# EAGLE design coronaampel_v2_fixed (EAGLE 6.4)

## Sheet 1 of 6
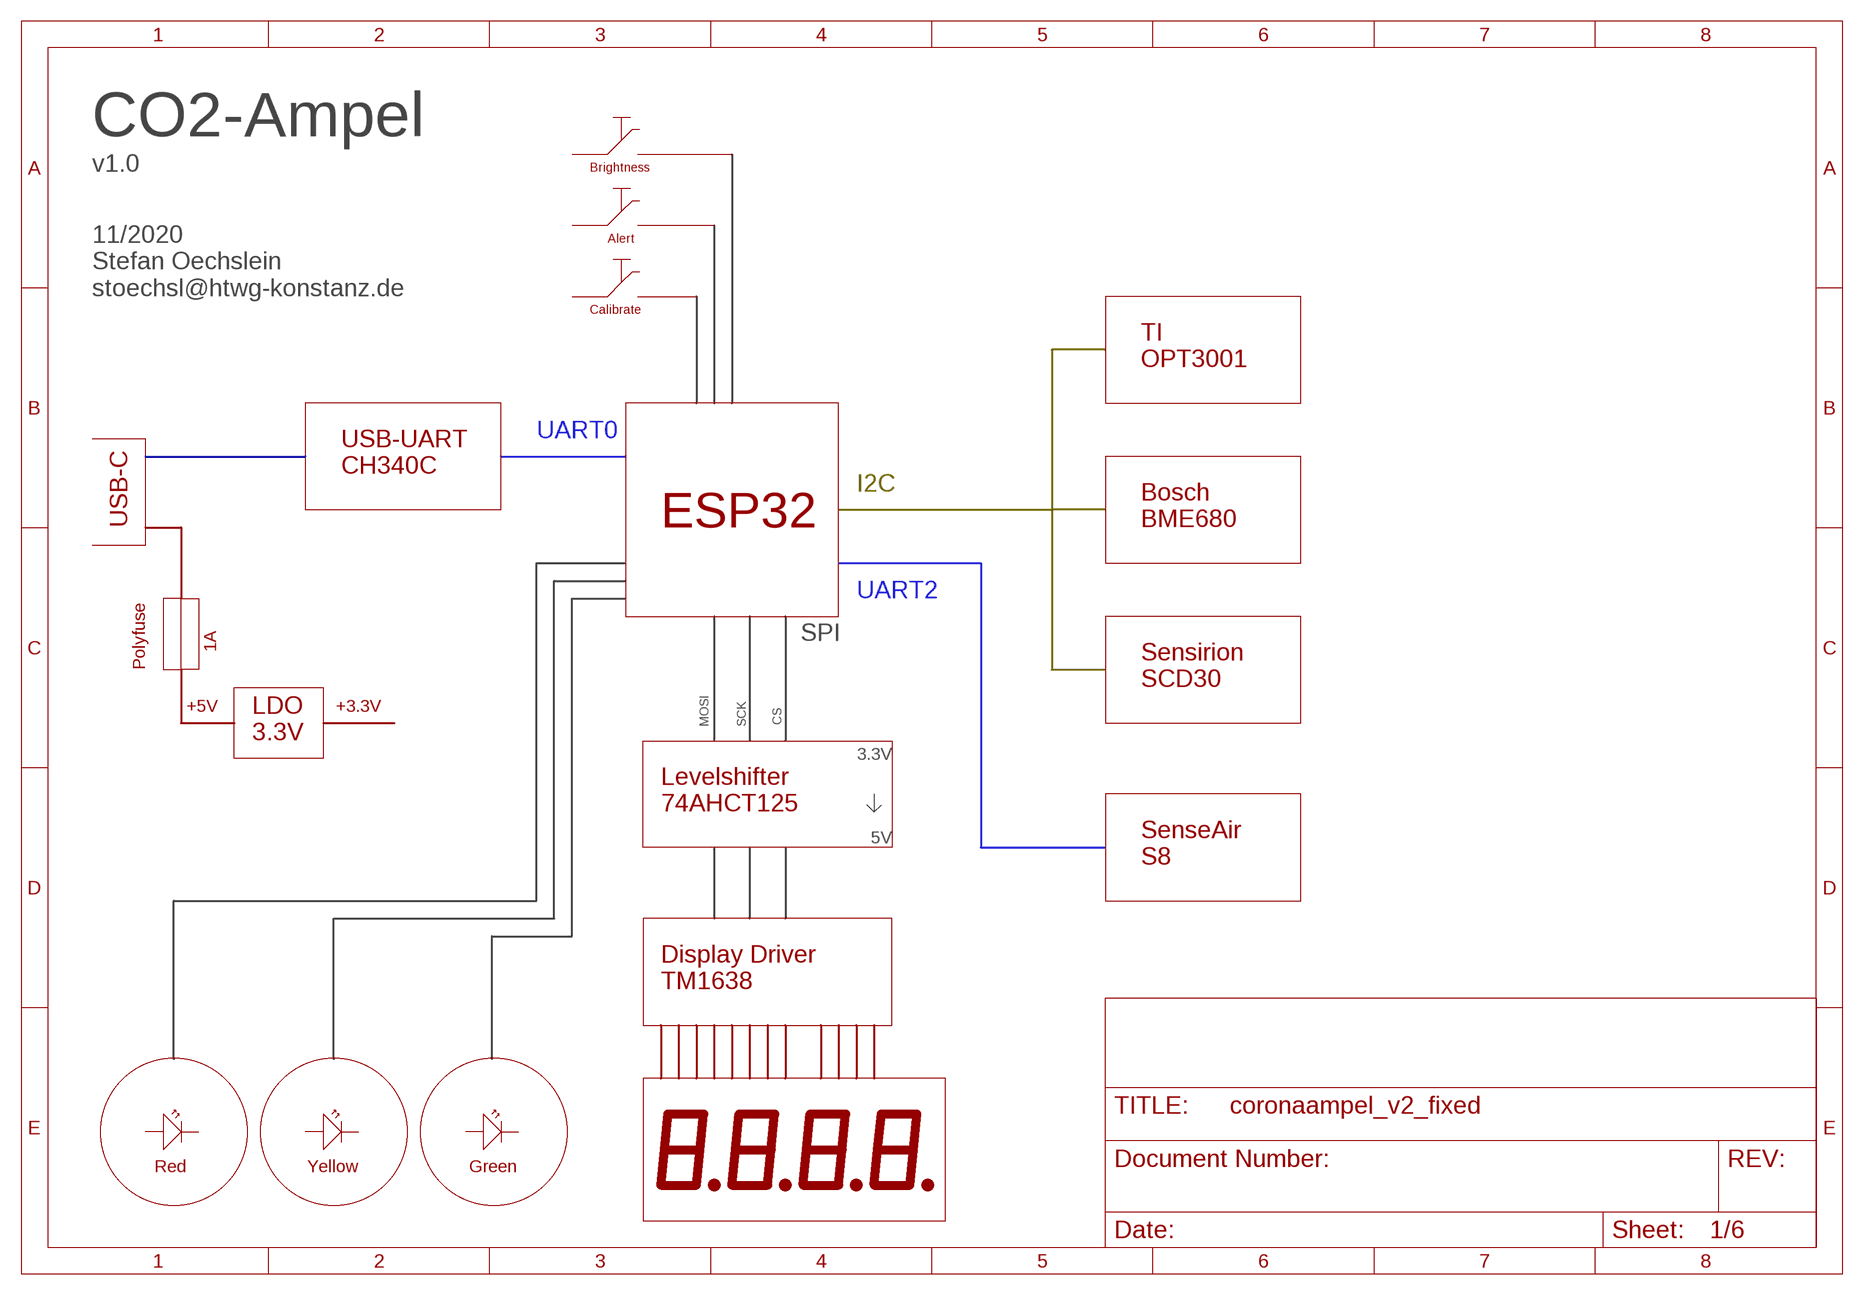
[diagram p0: schematic, sheet 1]

### Buses
B$1

### Notes on the sheet
- CO2-Ampel
- v1.0 | Brightness
- Alert
- 11/2020
  Stefan Oechslein
  stoechsl@htwg-konstanz.de
- Calibrate
- TI
  OPT3001
- UART0
- USB-UART
  CH340C
- I2C
- USB-C | ESP32
- Bosch
  BME680
- UART2
- SPI
- 1A
- Polyfuse
- Sensirion
  SCD30
- +5V | +3.3V
- MOSI | SCK | CS
- LDO
  3.3V
- 3.3V
- Levelshifter
  74AHCT125
- 5V
- SenseAir
  S8
- Display Driver
  TM1638
- Red | Yellow | Green

## Sheet 2 of 6: Supply & Programming
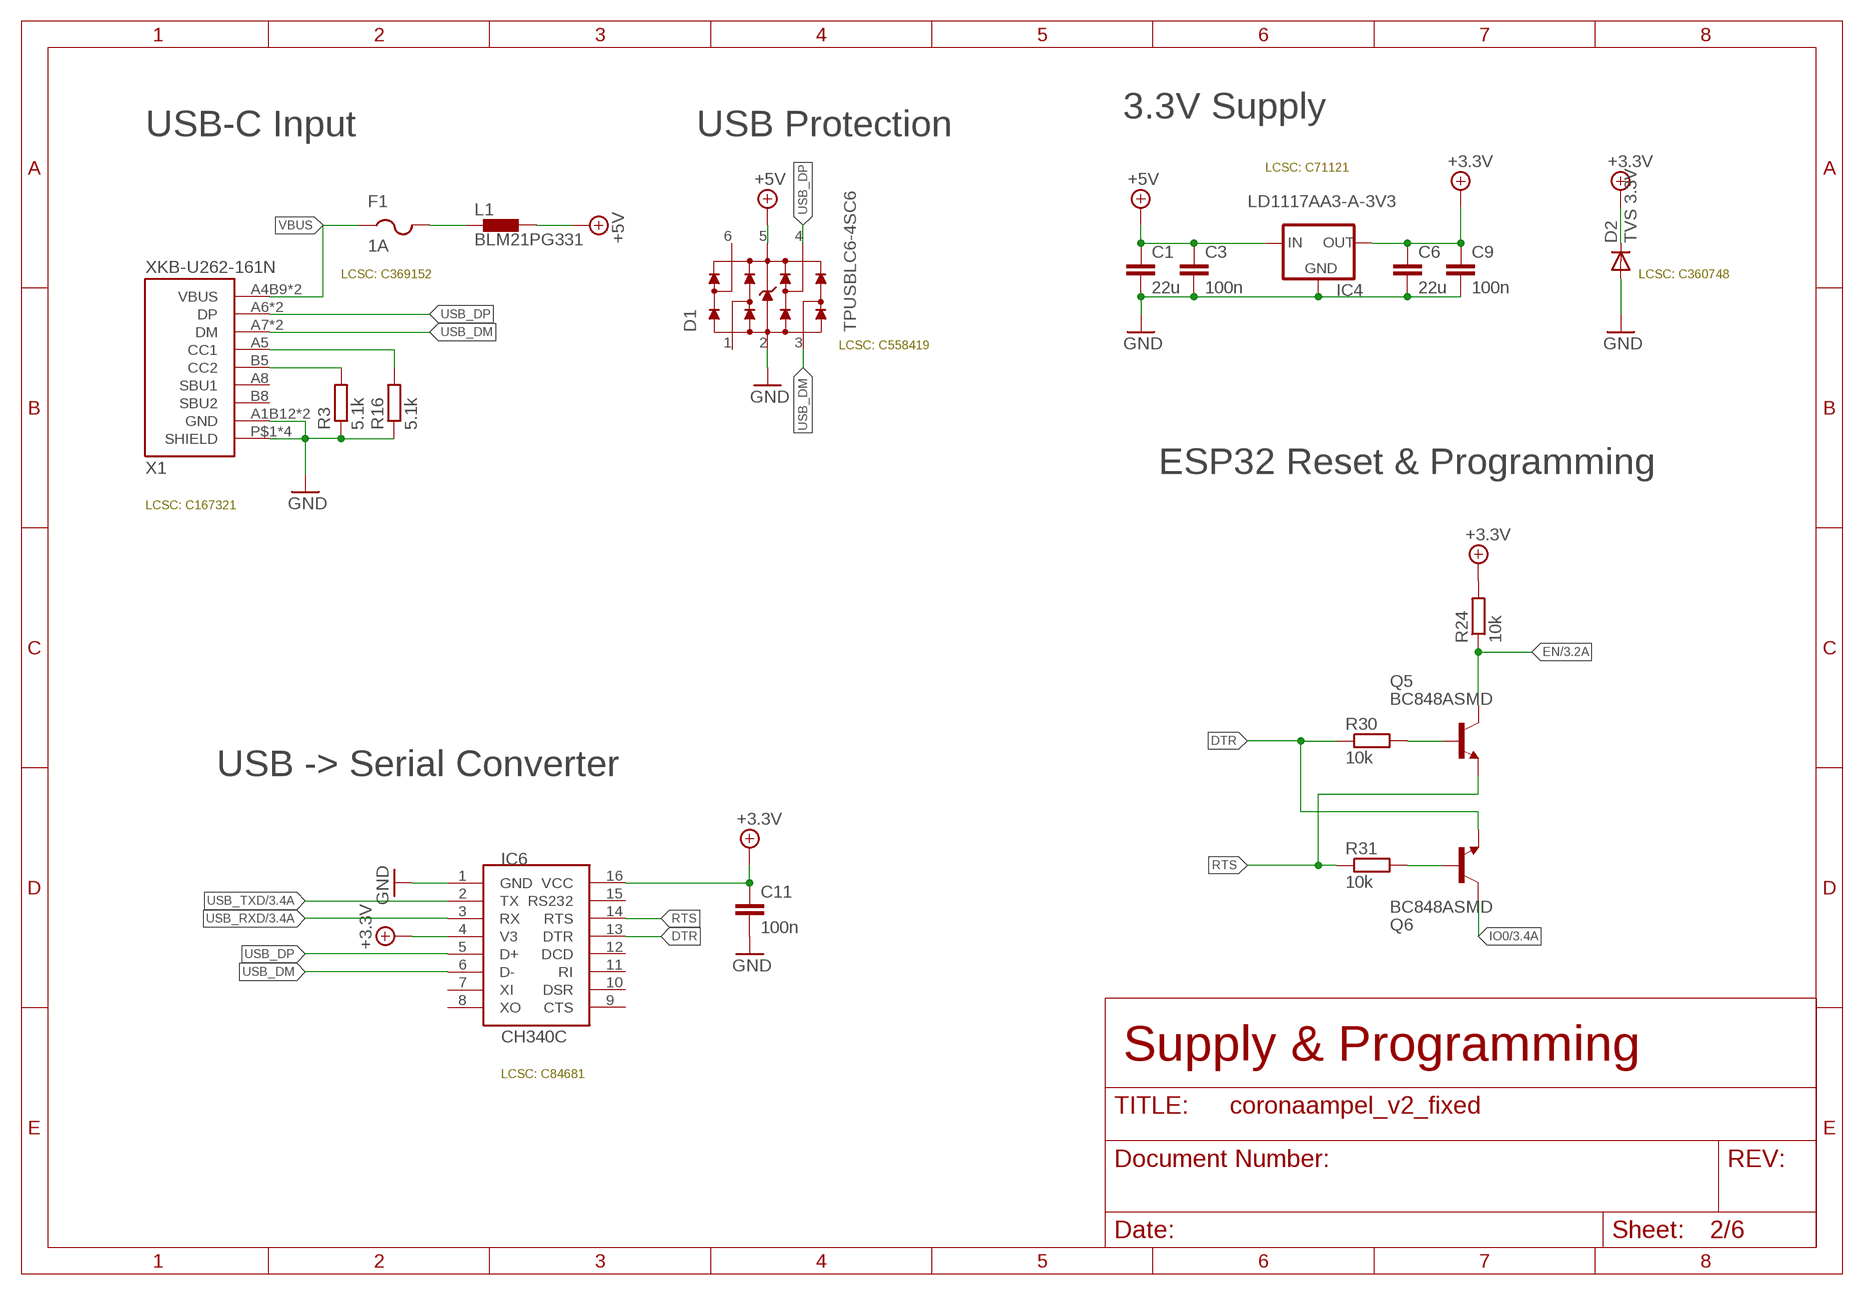
[diagram p1: schematic, sheet 2]

### Parts
C1  22u  C-EUC0805  [C0805]
C3  100n  C-EUC0805  [C0805]
C6  22u  C-EUC0805  [C0805]
C9  100n  C-EUC0805  [C0805]
C11  100n  C-EUC0805  [C0805]
D1  TPUSBLC6-4SC6  WE-TVS_824001  [WE-TVS_SOT23-6L]
D2  TVS 3.3V  DIODE-SOD123  [SOD123]
F1  1A  PTCFUSE-0805  [R0805]
IC4  LD1117AA3-A-3V3  LD1117AA3-A  [SOT223]
IC6  CH340C  CH340G  [SOIC16]
L1  BLM21PG331  [0805]
Q5  BC848ASMD  [SOT23]
Q6  BC848ASMD  [SOT23]
R3  5.1k  R-EU_R0805  [R0805]
R16  5.1k  R-EU_R0805  [R0805]
R24  10k  R-EU_R0805  [R0805]
R30  10k  R-EU_R0805  [R0805]
R31  10k  R-EU_R0805  [R0805]
X1  XKB-U262-161N  [XKB_U262-161N]

### Nets
+3,3V: C6.1 C9.1 C11.1 D2.C IC4.2(OUT) IC4.4(OUT) IC6.4(V3) IC6.16(VCC) R24.2 ; supply symbol labelled +3.3V ; also sheet 3,4,6
+5V: C1.1 C3.1 D1.5(VDD) IC4.3(IN) L1.2 ; also sheet 3,4,5,6
CC1: R16.2 X1.A5(CC1)
CC2: R3.2 X1.B5(CC2)
DTR: IC6.13(DTR) Q6.2(E) R30.1
EN: Q5.3(C) R24.1 ; also sheet 3
GND: C1.2 C3.2 C6.2 C9.2 C11.2 D1.2(GND) D2.A IC4.1(GND) IC6.1(GND) R3.1 R16.1 X1.A1B12(GND) X1.B1A12(GND) X1.P$1(SHIELD) X1.P$2(SHIELD) X1.P$3(SHIELD) X1.P$4(SHIELD) ; also sheet 3,4,5,6
IO0: Q6.3(C) ; also sheet 3
N$10: Q6.1(B) R31.2
N$13: Q5.1(B) R30.2
RTS: IC6.14(RTS) Q5.2(E) R31.1
USB_DM: D1.3 IC6.6(D-) X1.A7(DM) X1.B7(DM)
USB_DP: D1.4 IC6.5(D+) X1.A6(DP) X1.B6(DP)
USB_RXD: IC6.3(RX) ; also sheet 3
USB_TXD: IC6.2(TX) ; also sheet 3
VBUS: F1.1 X1.A4B9(VBUS) X1.B4A9(VBUS)
VIN: F1.2 L1.1
Unconnected: D1.1 D1.6 IC6.7(XI) IC6.8(XO) IC6.9(CTS) IC6.10(DSR) IC6.11(RI) IC6.12(DCD) IC6.15(RS232) X1.A8(SBU1) X1.B8(SBU2)

### Notes on the sheet
- 3.3V Supply
- USB-C Input | USB Protection
- LCSC: C71121
- LCSC: C369152 | LCSC: C360748
- LCSC: C558419
- ESP32 Reset & Programming
- LCSC: C167321
- USB -> Serial Converter
- Supply & Programming
- LCSC: C84681

## Sheet 3 of 6: ESP32
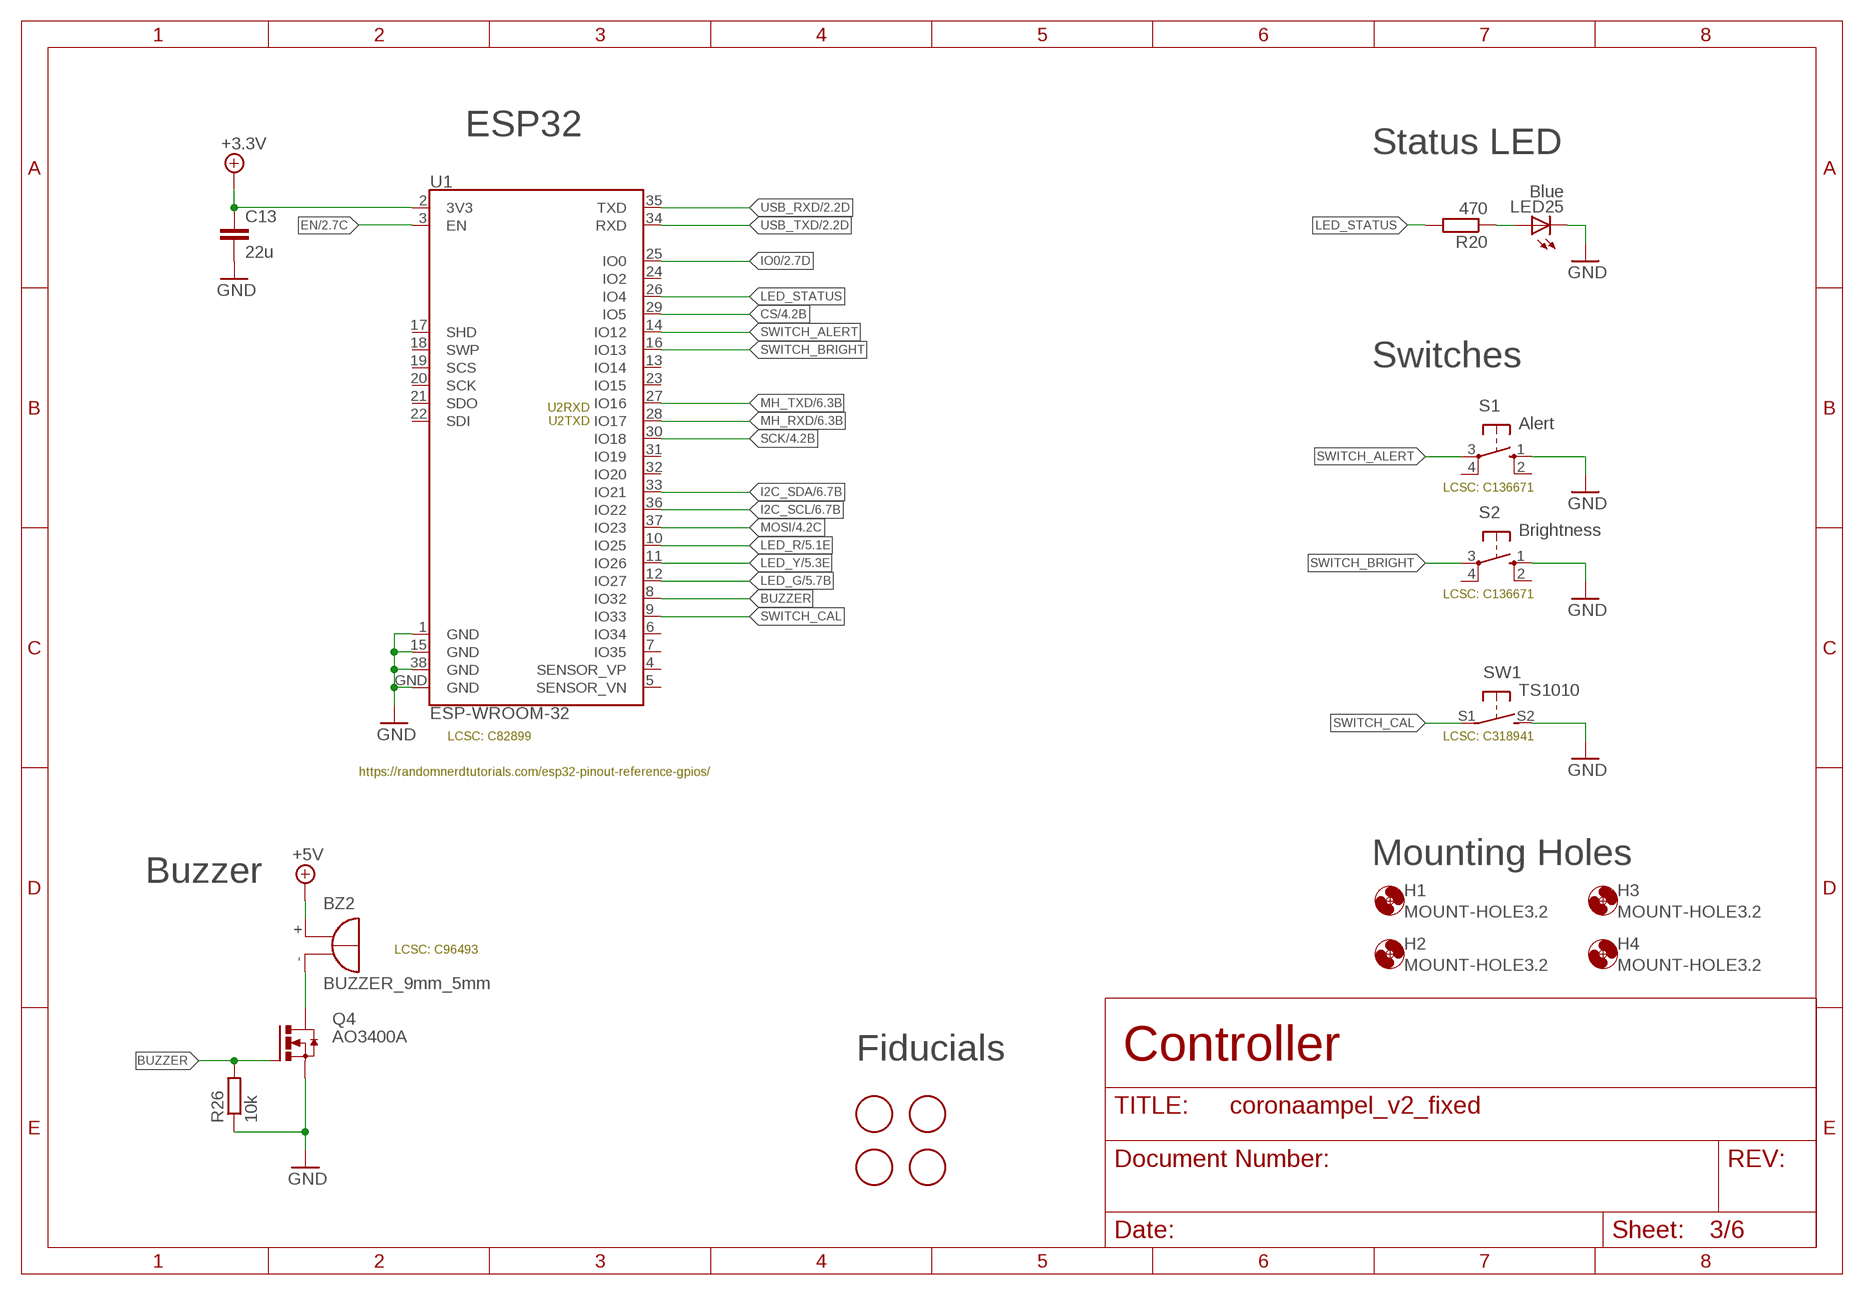
[diagram p2: schematic, sheet 3]

### Parts
BZ2  BUZZER_9mm_5mm  BUZ_9_5  [BUZ_9_5]
C13  22u  C-EUC0805  [C0805]
H1  MOUNT-HOLE3.2  [3,2]
H2  MOUNT-HOLE3.2  [3,2]
H3  MOUNT-HOLE3.2  [3,2]
H4  MOUNT-HOLE3.2  [3,2]
LED25  Blue  LEDCHIPLED_0805  [CHIPLED_0805]
Q4  AO3400A  IRLML2502  [MICRO3]
R20  470  R-EU_R0805  [R0805]
R26  10k  R-EU_R0805  [R0805]
S1  Alert  10-XX  [B3F-10XX]
S2  Brightness  10-XX  [B3F-10XX]
SW1  TS1010  [TS1010]
U1  ESP-WROOM-32  [ESP-WROOM-32]
U$4  FIDUCIAL  [FIDUCIAL_1MM]
U$6  FIDUCIAL  [FIDUCIAL_1MM]
U$7  FIDUCIAL  [FIDUCIAL_1MM]
U$8  FIDUCIAL  [FIDUCIAL_1MM]

### Nets
+3,3V: C13.1 U1.2(3V3) ; supply symbol labelled +3.3V ; also sheet 2,4,6
+5V: BZ2.+ ; also sheet 2,4,5,6
BUZ: BZ2.- Q4.3(D)
BUZZER: Q4.1(G) R26.2 U1.8(IO32)
CS: U1.29(IO5) ; also sheet 4
EN: U1.3(EN) ; also sheet 2
GND: C13.2 LED25.C Q4.2(S) R26.1 S1.1(S) S2.1(S) SW1.S2(S) U1.1(GND) U1.15(GND) U1.38(GND) U1.GND ; also sheet 2,4,5,6
I2C_SCL: U1.36(IO22) ; also sheet 6
I2C_SDA: U1.33(IO21) ; also sheet 6
IO0: U1.25(IO0) ; also sheet 2
LED_G: U1.12(IO27) ; also sheet 5
LED_R: U1.10(IO25) ; also sheet 5
LED_STATUS: R20.2 U1.26(IO4)
LED_Y: U1.11(IO26) ; also sheet 5
MH_RXD: U1.28(IO17) ; also sheet 6
MH_TXD: U1.27(IO16) ; also sheet 6
MOSI: U1.37(IO23) ; also sheet 4
N$1: LED25.A R20.1
SCK: U1.30(IO18) ; also sheet 4
SWITCH_ALERT: S1.3(P) U1.14(IO12)
SWITCH_BRIGHT: S2.3(P) U1.16(IO13)
SWITCH_CAL: SW1.S1(P) U1.9(IO33)
USB_RXD: U1.35(TXD) ; also sheet 2
USB_TXD: U1.34(RXD) ; also sheet 2
Unconnected: S1.2(S1) S1.4(P1) S2.2(S1) S2.4(P1) U1.4(SENSOR_VP) U1.5(SENSOR_VN) U1.6(IO34) U1.7(IO35) U1.13(IO14) U1.17(SHD) U1.18(SWP) U1.19(SCS) U1.20(SCK) U1.21(SDO) U1.22(SDI) U1.23(IO15) U1.24(IO2) U1.31(IO19) U1.32(IO20)

### Notes on the sheet
- ESP32
- Status LED
- Switches
- U2RXD
  U2TXD
- LCSC: C136671
- LCSC: C136671
- LCSC: C82899 | LCSC: C318941
- https://randomnerdtutorials.com/esp32-pinout-reference-gpios/
- Mounting Holes
- Buzzer
- LCSC: C96493
- Fiducials | Controller

## Sheet 4 of 6: Display
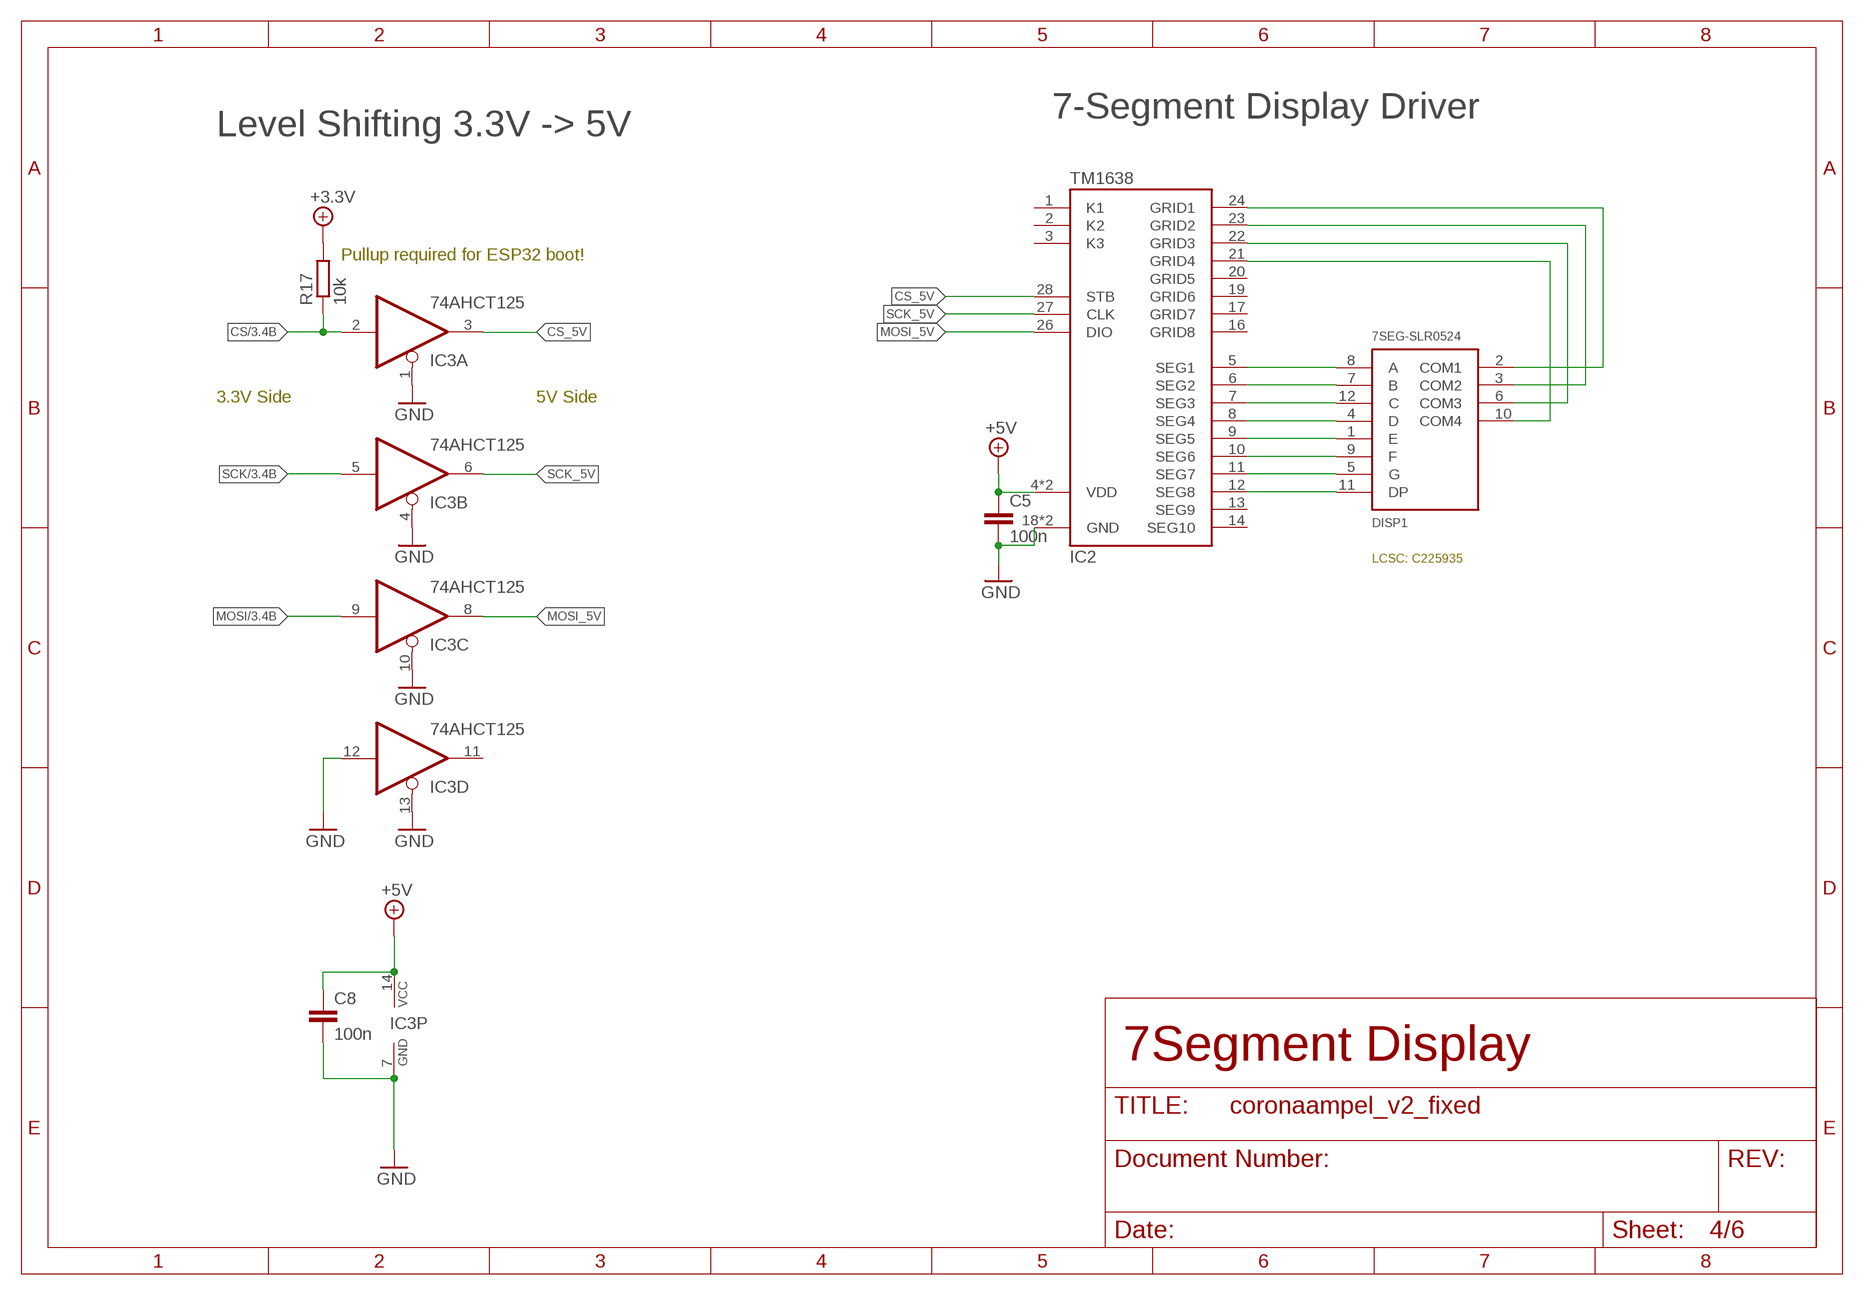
[diagram p3: schematic, sheet 4]

### Parts
C5  100n  C-EUC0805  [C0805]
C8  100n  C-EUC0805  [C0805]
DISP1  7SEG-SLR0524  [SEG-SLR0524]
IC2  TM1638  [SO-28L]
IC3  74AHCT125  74ABT125PW  [TSSOP14]
R17  10k  R-EU_R0805  [R0805]

### Nets
+3,3V: R17.2 ; supply symbol labelled +3.3V ; also sheet 2,3,6
+5V: C5.1 C8.1 IC2.4(VDD) IC2.15(VDD) IC3.14(P:VCC) ; also sheet 2,3,5,6
CS: IC3.2(A:I) R17.1 ; also sheet 3
CS_5V: IC2.28(STB) IC3.3(A:O)
GND: C5.2 C8.2 IC2.18(GND) IC2.25(GND) IC3.1(A:OE) IC3.4(B:OE) IC3.7(P:GND) IC3.10(C:OE) IC3.12(D:I) IC3.13(D:OE) ; also sheet 2,3,5,6
GRID1: DISP1.2(COM1) IC2.24(GRID1)
GRID2: DISP1.3(COM2) IC2.23(GRID2)
GRID3: DISP1.6(COM3) IC2.22(GRID3)
GRID4: DISP1.10(COM4) IC2.21(GRID4)
MOSI: IC3.9(C:I) ; also sheet 3
MOSI_5V: IC2.26(DIO) IC3.8(C:O)
SCK: IC3.5(B:I) ; also sheet 3
SCK_5V: IC2.27(CLK) IC3.6(B:O)
SEG1: DISP1.8(A) IC2.5(SEG1)
SEG2: DISP1.7(B) IC2.6(SEG2)
SEG3: DISP1.12(C) IC2.7(SEG3)
SEG4: DISP1.4(D) IC2.8(SEG4)
SEG5: DISP1.1(E) IC2.9(SEG5)
SEG6: DISP1.9(F) IC2.10(SEG6)
SEG7: DISP1.5(G) IC2.11(SEG7)
SEG8: DISP1.11(DP) IC2.12(SEG8)
Unconnected: IC2.1(K1) IC2.2(K2) IC2.3(K3) IC2.13(SEG9) IC2.14(SEG10) IC2.16(GRID8) IC2.17(GRID7) IC2.19(GRID6) IC2.20(GRID5) IC3.11(D:O)

### Notes on the sheet
- 7-Segment Display Driver
- Level Shifting 3.3V -> 5V
- Pullup required for ESP32 boot!
- 3.3V Side | 5V Side
- LCSC: C225935
- 7Segment Display

## Sheet 5 of 6: LEDs
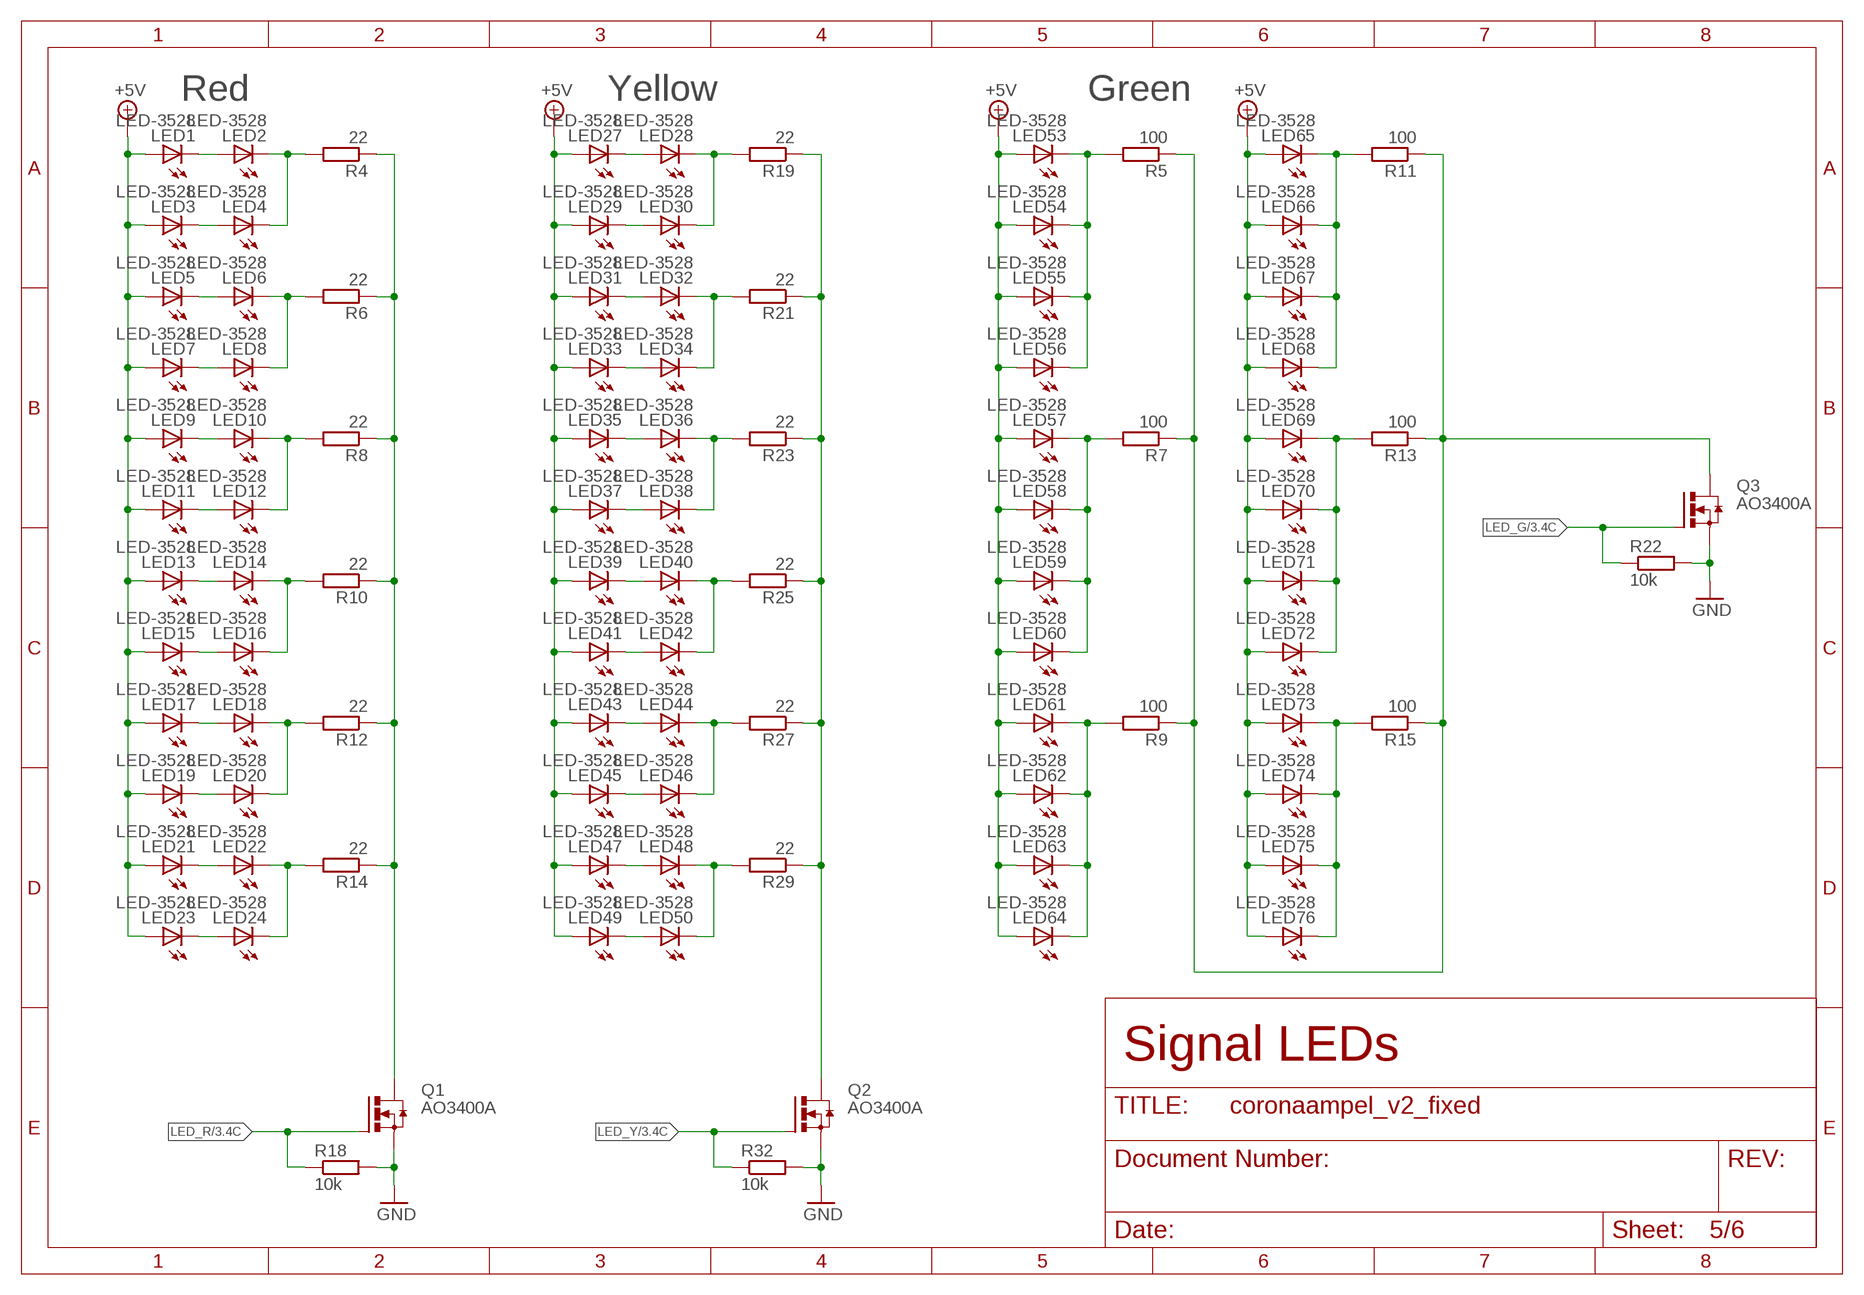
[diagram p4: schematic, sheet 5]

### Parts
LED1  LED-3528  [3528]
LED2  LED-3528  [3528]
LED3  LED-3528  [3528]
LED4  LED-3528  [3528]
LED5  LED-3528  [3528]
LED6  LED-3528  [3528]
LED7  LED-3528  [3528]
LED8  LED-3528  [3528]
LED9  LED-3528  [3528]
LED10  LED-3528  [3528]
LED11  LED-3528  [3528]
LED12  LED-3528  [3528]
LED13  LED-3528  [3528]
LED14  LED-3528  [3528]
LED15  LED-3528  [3528]
LED16  LED-3528  [3528]
LED17  LED-3528  [3528]
LED18  LED-3528  [3528]
LED19  LED-3528  [3528]
LED20  LED-3528  [3528]
LED21  LED-3528  [3528]
LED22  LED-3528  [3528]
LED23  LED-3528  [3528]
LED24  LED-3528  [3528]
LED27  LED-3528  [3528]
LED28  LED-3528  [3528]
LED29  LED-3528  [3528]
LED30  LED-3528  [3528]
LED31  LED-3528  [3528]
LED32  LED-3528  [3528]
LED33  LED-3528  [3528]
LED34  LED-3528  [3528]
LED35  LED-3528  [3528]
LED36  LED-3528  [3528]
LED37  LED-3528  [3528]
LED38  LED-3528  [3528]
LED39  LED-3528  [3528]
LED40  LED-3528  [3528]
LED41  LED-3528  [3528]
LED42  LED-3528  [3528]
LED43  LED-3528  [3528]
LED44  LED-3528  [3528]
LED45  LED-3528  [3528]
LED46  LED-3528  [3528]
LED47  LED-3528  [3528]
LED48  LED-3528  [3528]
LED49  LED-3528  [3528]
LED50  LED-3528  [3528]
LED53  LED-3528  [3528]
LED54  LED-3528  [3528]
LED55  LED-3528  [3528]
LED56  LED-3528  [3528]
LED57  LED-3528  [3528]
LED58  LED-3528  [3528]
LED59  LED-3528  [3528]
LED60  LED-3528  [3528]
LED61  LED-3528  [3528]
LED62  LED-3528  [3528]
LED63  LED-3528  [3528]
LED64  LED-3528  [3528]
LED65  LED-3528  [3528]
LED66  LED-3528  [3528]
LED67  LED-3528  [3528]
LED68  LED-3528  [3528]
LED69  LED-3528  [3528]
LED70  LED-3528  [3528]
LED71  LED-3528  [3528]
LED72  LED-3528  [3528]
LED73  LED-3528  [3528]
LED74  LED-3528  [3528]
LED75  LED-3528  [3528]
LED76  LED-3528  [3528]
Q1  AO3400A  IRLML2502  [MICRO3]
Q2  AO3400A  IRLML2502  [MICRO3]
Q3  AO3400A  IRLML2502  [MICRO3]
R4  22  R-EU_R0805  [R0805]
R5  100  R-EU_R0805  [R0805]
R6  22  R-EU_R0805  [R0805]
R7  100  R-EU_R0805  [R0805]
R8  22  R-EU_R0805  [R0805]
R9  100  R-EU_R0805  [R0805]
R10  22  R-EU_R0805  [R0805]
R11  100  R-EU_R0805  [R0805]
R12  22  R-EU_R0805  [R0805]
R13  100  R-EU_R0805  [R0805]
R14  22  R-EU_R0805  [R0805]
R15  100  R-EU_R0805  [R0805]
R18  10k  R-EU_R0805  [R0805]
R19  22  R-EU_R0805  [R0805]
R21  22  R-EU_R0805  [R0805]
R22  10k  R-EU_R0805  [R0805]
R23  22  R-EU_R0805  [R0805]
R25  22  R-EU_R0805  [R0805]
R27  22  R-EU_R0805  [R0805]
R29  22  R-EU_R0805  [R0805]
R32  10k  R-EU_R0805  [R0805]

### Nets
+5V: LED1.A LED3.A LED5.A LED7.A LED9.A LED11.A LED13.A LED15.A LED17.A LED19.A LED21.A LED23.A LED27.A LED29.A LED31.A LED33.A LED35.A LED37.A LED39.A LED41.A LED43.A LED45.A LED47.A LED49.A LED53.A LED54.A LED55.A LED56.A LED57.A LED58.A LED59.A LED60.A LED61.A LED62.A LED63.A LED64.A LED65.A LED66.A LED67.A LED68.A LED69.A LED70.A LED71.A LED72.A LED73.A LED74.A LED75.A LED76.A ; also sheet 2,3,4,6
GND: Q1.2(S) Q2.2(S) Q3.2(S) R18.2 R22.2 R32.2 ; also sheet 2,3,4,6
LED_G: Q3.1(G) R22.1 ; also sheet 3
LED_G_GND: Q3.3(D) R5.1 R7.1 R9.1 R11.1 R13.1 R15.1
LED_R: Q1.1(G) R18.1 ; also sheet 3
LED_R_GND: Q1.3(D) R4.1 R6.1 R8.1 R10.1 R12.1 R14.1
LED_Y: Q2.1(G) R32.1 ; also sheet 3
LED_Y_GND: Q2.3(D) R19.1 R21.1 R23.1 R25.1 R27.1 R29.1
N$3: LED1.C LED2.A
N$4: LED3.C LED4.A
N$5: LED5.C LED6.A
N$6: LED2.C LED4.C R4.2
N$7: LED53.C LED54.C LED55.C LED56.C R5.2
N$8: LED6.C LED8.C R6.2
N$9: LED7.C LED8.A
N$11: LED9.C LED10.A
N$12: LED11.C LED12.A
N$14: LED10.C LED12.C R8.2
N$15: LED57.C LED58.C LED59.C LED60.C R7.2
N$16: LED13.C LED14.A
N$17: LED15.C LED16.A
N$18: LED17.C LED18.A
N$19: LED14.C LED16.C R10.2
N$21: LED18.C LED20.C R12.2
N$22: LED19.C LED20.A
N$23: LED61.C LED62.C LED63.C LED64.C R9.2
N$24: LED21.C LED22.A
N$25: LED23.C LED24.A
N$26: LED22.C LED24.C R14.2
N$30: LED27.C LED28.A
N$31: LED29.C LED30.A
N$32: LED31.C LED32.A
N$33: LED28.C LED30.C R19.2
N$34: LED65.C LED66.C LED67.C LED68.C R11.2
N$35: LED32.C LED34.C R21.2
N$36: LED33.C LED34.A
N$37: LED35.C LED36.A
N$38: LED37.C LED38.A
N$40: LED36.C LED38.C R23.2
N$41: LED69.C LED70.C LED71.C LED72.C R13.2
N$42: LED39.C LED40.A
N$43: LED41.C LED42.A
N$44: LED43.C LED44.A
N$45: LED40.C LED42.C R25.2
N$46: LED73.C LED74.C LED75.C LED76.C R15.2
N$47: LED44.C LED46.C R27.2
N$48: LED45.C LED46.A
N$50: LED47.C LED48.A
N$51: LED49.C LED50.A
N$52: LED48.C LED50.C R29.2

### Notes on the sheet
- Red | Yellow | Green
- Signal LEDs

## Sheet 6 of 6: Sensors
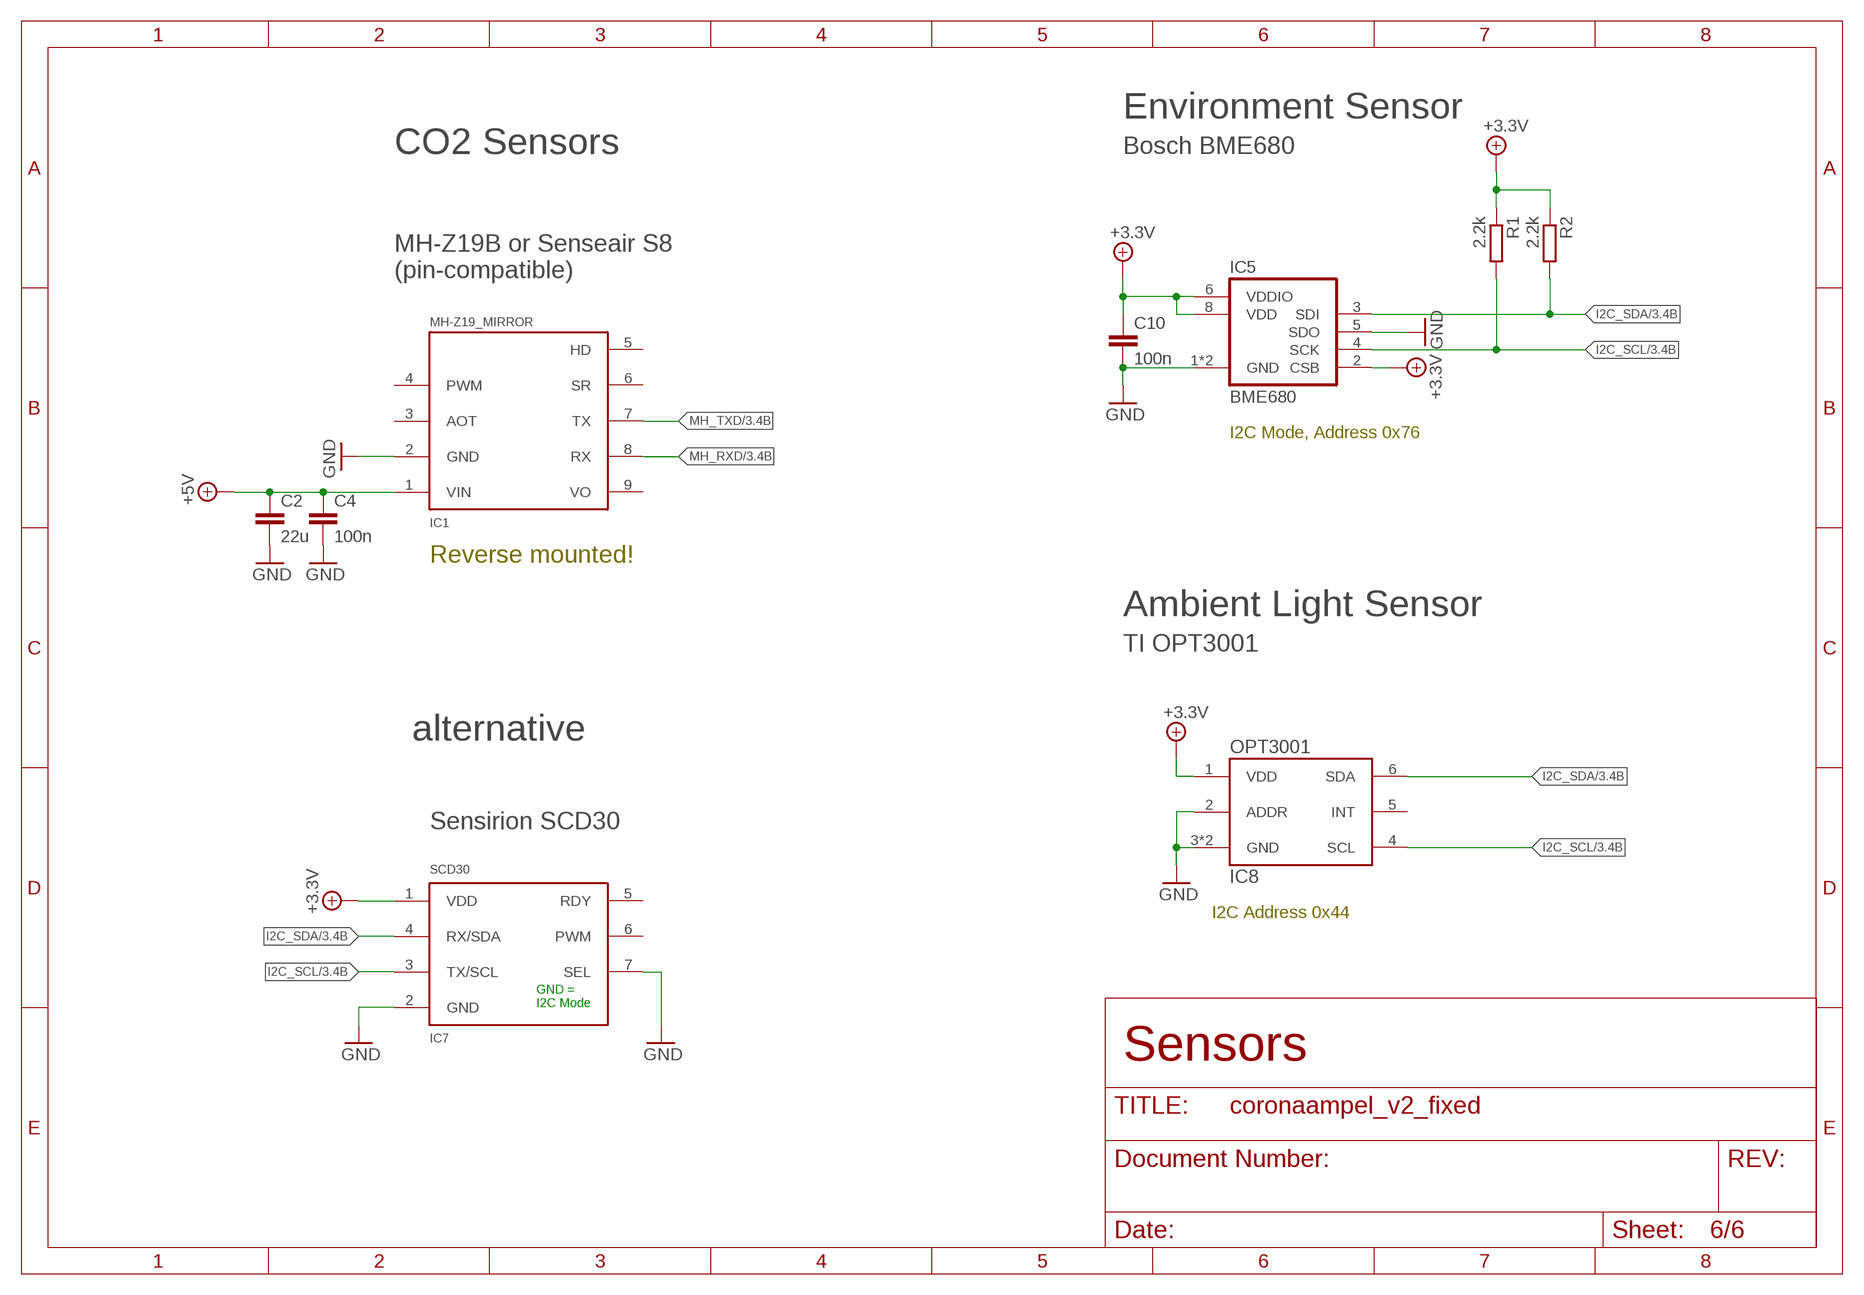
[diagram p5: schematic, sheet 6]

### Parts
C2  22u  C-EUC0805  [C0805]
C4  100n  C-EUC0805  [C0805]
C10  100n  C-EUC0805  [C0805]
IC1  MH-Z19_MIRROR  [MH-Z19_MIRROR]
IC5  BME680  [BME680]
IC7  SCD30  [SCD30]
IC8  OPT3001  [USON6]
R1  2.2k  R-EU_R0805  [R0805]
R2  2.2k  R-EU_R0805  [R0805]

### Nets
+3,3V: C10.1 IC5.2(CSB) IC5.6(VDDIO) IC5.8(VDD) IC7.1(VDD) IC8.1(VDD) R1.1 R2.1 ; supply symbol labelled +3.3V ; also sheet 2,3,4
+5V: C2.1 C4.1 IC1.1(VIN) ; also sheet 2,3,4,5
GND: C2.2 C4.2 C10.2 IC1.2(GND) IC5.1(GND) IC5.5(SDO) IC5.7(GND) IC7.2(GND) IC7.7(SEL) IC8.2(ADDR) IC8.3(GND) IC8.EP(GND) ; also sheet 2,3,4,5
I2C_SCL: IC5.4(SCK) IC7.3(TX/SCL) IC8.4(SCL) R1.2 ; also sheet 3
I2C_SDA: IC5.3(SDI) IC7.4(RX/SDA) IC8.6(SDA) R2.2 ; also sheet 3
MH_RXD: IC1.8(RX) ; also sheet 3
MH_TXD: IC1.7(TX) ; also sheet 3
Unconnected: IC1.3(AOT) IC1.4(PWM) IC1.5(HD) IC1.6(SR) IC1.9(VO) IC7.5(RDY) IC7.6(PWM) IC8.5(INT)

### Notes on the sheet
- Environment Sensor
- CO2 Sensors | Bosch BME680
- MH-Z19B or Senseair S8
  (pin-compatible)
- I2C Mode, Address 0x76
- Reverse mounted!
- Ambient Light Sensor
- TI OPT3001
- alternative
- Sensirion SCD30
- I2C Address 0x44
- GND =
  I2C Mode
- Sensors

## Library data of the parts
BZ2 = buzzer:BUZ_9_5
C1-C6 C8-C11 C13 = rcl:C-EU: CAPACITOR, European symbol
D1 = EagleLibrary_Wuerth_Elektronik_eiSos_rev16a:WE-TVS_824001: TVS Diode High Speed Series Characteristics Low clamping voltage Sturdy design Very low capacitance Flow Thru Design for a simple layout Rail to Rail protection Epoxy flame resistant UL94 V-0 RoHS, REACH and free of halogens Applications Very fast data lines USB 2.0 Ethernet PoE VGA Sim Cards Keypads ESD protection in accordance with EN 61000-4-2, – 8 kV contact discharge – 15 kV air discharge <http://katalog.we-online.de/media/images/eisos/VarTVS_highspeed_pf2.jpg.jpg> Details see: http://katalog.we-online.de/en/pbs/WE-TVS_High_Speed/824001? Updated by Dan Xu 2014-07-11 2014 (C) Wurth Elektronik
D2 = diode:DIODE-: DIODE
DISP1 = 7segment:7SEG-SLR0524: https://datasheet.lcsc.com/szlcsc/1810191632_SUNLIGHT-SLR0524DWC1BD_C225935.pdf
F1 = adafruit:PTCFUSE: PTC fuses, resettable thermistors
H1-H4 = holes:MOUNT-HOLE: MOUNTING HOLE with drill center marker
IC1 = sensor-winsen:MH-Z19: MH-Z19B NDIR CO2 Sensor
IC2 = titan-micro:TM1638: TM1638 LED Driver Controller, 10 Segments x 8 Grids
IC3 = 74xx-eu:74*125: Quad bus BUFFER, 3-state
IC4 = v-reg:LD1117: LD1117 LOW DROP FIXED AND ADJUSTABLE POSITIVE VOLTAGE REGULATORS https://datasheet.lcsc.com/szlcsc/Unisonic-Tech-LD1117AG-18-AB3-A-R_C75482.pdf
IC5 = bosch-bme680:BME680: BME680 integrates for the first time individual high linearity and high accuracy sensors for gas, pressure, humidity and temperature. The library has been designed by Richard Magdycz <https://www.facebook.com/groups/eaglecadsoftUK>
IC6 = usb-serial:CH340G: CH340G USB to UART Interface
IC7 = Sensirion:SCD30: Sensirion SCD30 CO2, humidity, and temperature sensor
IC8 = texas:OPT3001: OPT3001 I2C Ambient Light Sensor
L1 = inductors:BLM21: EMIFIL (R) Chip Ferrite Bead high frequency noise BLM21AG102 1000 Ohm; 0,2A BLM21AG121 120 Ohm; 0,2A BLM21AG221 220 Ohm; 2A BLM21AG601 600 Ohm; 0,2A BLM21PG221 220 Ohm; 2A BLM21PG300 30 Ohm; 3A BLM21PG331 330 Ohm; 1,5A BLM21PG600 60 Ohm; 3A
LED1-LED24 LED27-LED50 LED53-LED76 = led:LED-3528: LED 3528
LED25 = led:LED: LED OSRAM: - CHIPLED LG R971, LG N971, LY N971, LG Q971, LY Q971, LO R971, LY R971 LH N974, LH R974 LS Q976, LO Q976, LY Q976 LO Q996 - Hyper CHIPLED LW Q18S LB Q993, LB Q99A, LB R99A - SideLED LS A670, LO A670, LY A670, LG A670, LP A670 LB A673, LV A673, LT A673, LW A673 LH A674 LY A675 LS A676, LA A676, LO A676, LY A676, LW A676 LS A679, LY A679, LG A679 - Hyper Micro SIDELED® LS Y876, LA Y876, LO Y876, LY Y876 LT Y87S - SmartLED LW L88C, LW L88S LB L89C, LB L89S, LG L890 LS L89K, LO L89K, LY L89K LS L896, LA L896, LO L896, LY L896 - TOPLED LS T670, LO T670, LY T670, LG T670, LP T670 LSG T670, LSP T670, LSY T670, LOP T670, LYG T670 LG T671, LOG T671, LSG T671 LB T673, LV T673, LT T673, LW T673 LH T674 LS T676, LA T676, LO T676, LY T676, LB T676, LH T676, LSB T676, LW T676 LB T67C, LV T67C, LT T67C, LS T67K, LO T67K, LY T67K, LW E67C LS E67B, LA E67B, LO E67B, LY E67B, LB E67C, LV E67C, LT E67C LW T67C LS T679, LY T679, LG T679 LS T770, LO T770, LY T770, LG T770, LP T770 LB T773, LV T773, LT T773, LW T773 LH T774 LS E675, LA E675, LY E675, LS T675 LS T776, LA T776, LO T776, LY T776, LB T776 LHGB T686 LT T68C, LB T68C - Hyper Mini TOPLED® LB M676 - Mini TOPLED Santana® LG M470 LS M47K, LO M47K, LY M47K Source: http://www.osram.convergy.de LUXEON: - LUMILED® LXK2-PW12-R00, LXK2-PW12-S00, LXK2-PW14-U00, LXK2-PW14-V00 LXK2-PM12-R00, LXK2-PM12-S00, LXK2-PM14-U00 LXK2-PE12-Q00, LXK2-PE12-R00, LXK2-PE12-S00, LXK2-PE14-T00, LXK2-PE14-U00 LXK2-PB12-K00, LXK2-PB12-L00, LXK2-PB12-M00, LXK2-PB14-N00, LXK2-PB14-P00, LXK2-PB14-Q00 LXK2-PR12-L00, LXK2-PR12-M00, LXK2-PR14-Q00, LXK2-PR14-R00 LXK2-PD12-Q00, LXK2-PD12-R00, LXK2-PD12-S00 LXK2-PH12-R00, LXK2-PH12-S00 LXK2-PL12-P00, LXK2-PL12-Q00, LXK2-PL12-R00 Source: www.luxeon.com KINGBRIGHT: KA-3528ASYC Source: www.kingbright.com
Q1-Q4 = transistor-power:IRLML2502: HEXFET N-Channel Power MOSFET
Q5 Q6 = transistor-npn:BC848*: NPN Transistor
R1-R27 R29-R32 = rcl:R-EU_: RESISTOR, European symbol
S1 S2 = switch-omron:10-XX: OMRON SWITCH; MPN: B3F-1000; OC_FARNELL: 176432; OC_NEWARK: 36M3542
SW1 = switch-xkb:TS1010: TS1010 XKB Enterprises https://datasheet.lcsc.com/szlcsc/2002271735_XKB-Connectivity-TS-1010-B-A_C318941.pdf
U1 = SparkFun-RF:ESP-WROOM-32; PROD_ID: IC-13849
U$4 U$6-U$8 = adafruit:FIDUCIAL: For use by pick and place machines to calibrate the vision/machine, 1mm By microbuilder.eu
X1 = con-xkb:XKB-U262-161N: XKB Enterprise U262-161N USB-C Connector https://datasheet.lcsc.com/szlcsc/2002271811_XKB-Enterprise-U262-161N-4BVC11_C319148.pdf

## Board
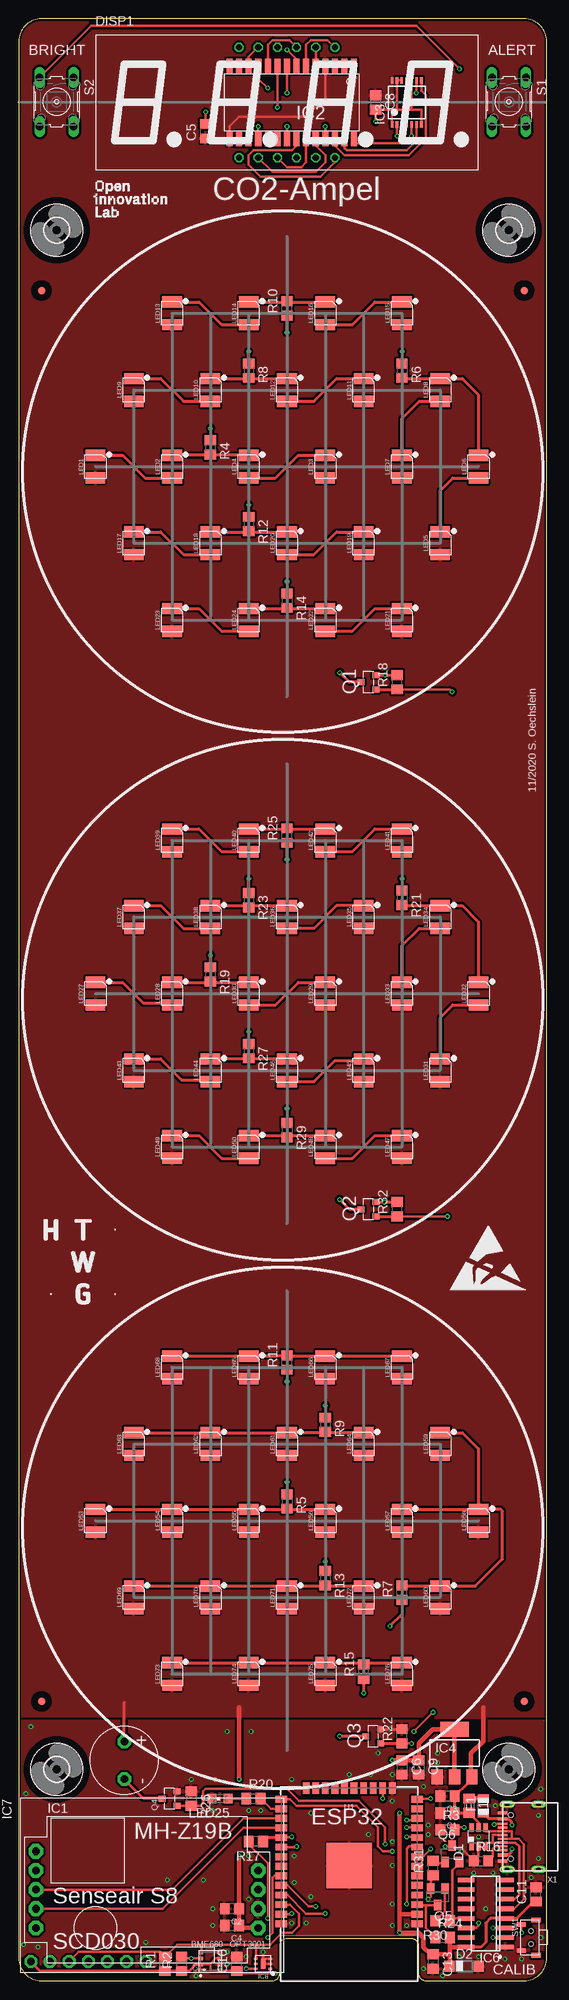
[diagram p6: board, top side]
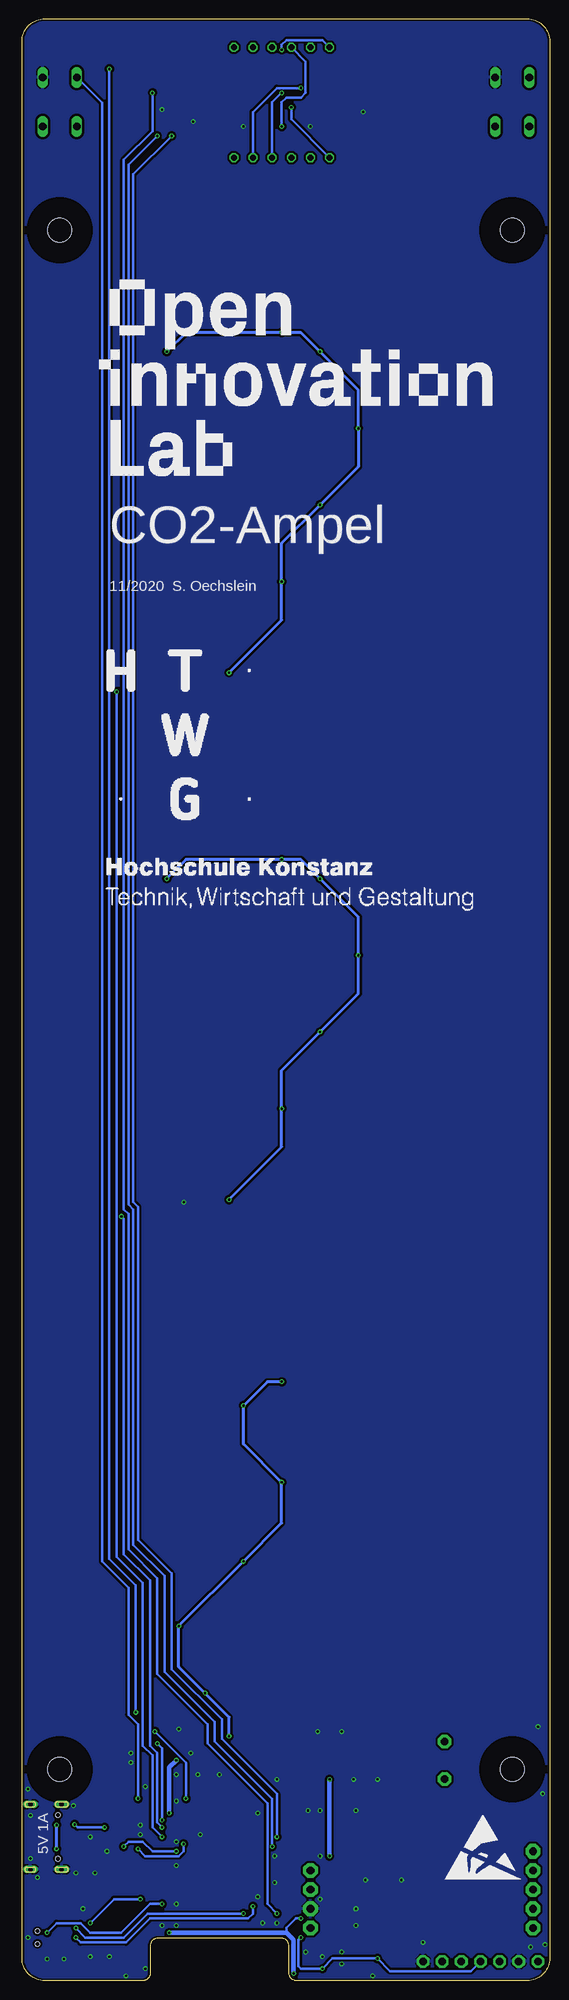
[diagram p7: board, bottom side, seen from below]

Size 70 x 260 mm. Coordinates in mm from the lower left corner, seen from the top.
Outline: 0,257 0,3 arc90 3,0 33.6,0 arc90 34.6,1 34.6,4.6 arc-90 35.6,5.6 52,5.6 arc-90 53,4.6 53,1 arc90 54,0 67,0 arc90 70,3 70,257 arc90 67,260 3,260 arc90 0,257
Copper layers (1*16): Top 0.035mm / dielectric 1.5mm / Bottom 0.035mm
Design rules "PCB-POOL Standard *": minimum track width 0.15mm, minimum drill 0.3mm, track to track 0.15mm, track to pad 0.15mm, pad to pad 0.15mm, via to via 0.15mm, smd to smd 0.15mm, copper to edge 0.3mm, drill to drill 0.2mm, minimum pad ring 0.2mm, minimum via ring 0.15mm, stop-mask expansion 0.075mm, vias tented up to drill 0.3mm, thermal gap 0.2mm

### Footprints (pad centres in the part's own frame; a part is rotated, then mirrored left to right if it is on the bottom)
BUZ_9_5 = drill 1 pad 1.778 octagon: + 2.5,0; - -2.5,0
C0805 = smd 1.3 x 1.5: 1 -0.95,0; 2 0.95,0
WE-TVS_SOT23-6L = smd 0.6 x 1.1: 1 -0.95,-1.25; 2 0,-1.25; 3 0.95,-1.25; 4 0.95,1.25; 5 0,1.25; 6 -0.95,1.25
SOD123 = smd 1.4 x 1.4: A 1.9,0; C -1.9,0
SEG-SLR0524 = drill 0.8 octagon: 1 -6.35,-7.3; 2 -3.81,-7.3; 3 -1.27,-7.3; 4 1.27,-7.3; 5 3.81,-7.3; 6 6.35,-7.3; 7 6.35,7.3; 8 3.81,7.3; 9 1.27,7.3; 10 -1.27,7.3; 11 -3.81,7.3; 12 -6.35,7.3
R0805 = smd 1.1 x 1.4: 1 -1,0; 2 1,0
3,2 = hole 3.2: 0,0
MH-Z19_MIRROR = drill 1 pad 1.93 octagon: 1 0,0; 2 0,2.54; 3 0,5.08; 4 0,7.62; 5 -29.5,10.16; 6 -29.5,7.62; 7 -29.5,5.08; 8 -29.5,2.54; 9 -29.5,0
SO-28L = smd 0.8 x 2: 1 -8.255,-4.826; 2 -6.985,-4.826; 3 -5.715,-4.826; 4 -4.445,-4.826; 5 -3.175,-4.826; 6 -1.905,-4.826; 7 -0.635,-4.826; 8 0.635,-4.826; 9 1.905,-4.826; 10 3.175,-4.826; 11 4.445,-4.826; 12 5.715,-4.826; 13 6.985,-4.826; 14 8.255,-4.826; 15 8.255,4.826; 16 6.985,4.826; 17 5.715,4.826; 18 4.445,4.826; 19 3.175,4.826; 20 1.905,4.826; 21 0.635,4.826; 22 -0.635,4.826; 23 -1.905,4.826; 24 -3.175,4.826; 25 -4.445,4.826; 26 -5.715,4.826; 27 -6.985,4.826; 28 -8.255,4.826
TSSOP14 = smd 0.35 x 0.9: 1 -1.95,-2.925; 2 -1.3,-2.925; 3 -0.65,-2.925; 4 0,-2.925; 5 0.65,-2.925; 6 1.3,-2.925; 7 1.95,-2.925; 8 1.95,2.925; 9 1.3,2.925; 10 0.65,2.925; 11 0,2.925; 12 -0.65,2.925; 13 -1.3,2.925; 14 -1.95,2.925
SOT223 = smd 1.5 x 2: 1 -2.3,-3.15; 2 0,-3.15; 3 2.3,-3.15 | smd 3.8 x 2: 4 0,3.15
BME680 = smd 0.45 x 0.45: 1 -1.2,1.2; 2 -0.4,1.2; 3 0.4,1.2; 4 1.2,1.2; 5 1.2,-1.2; 6 0.4,-1.2; 7 -0.4,-1.2; 8 -1.2,-1.2
SOIC16 = smd 0.6 x 2.2: 1 -4.445,-2.6; 2 -3.175,-2.6; 3 -1.905,-2.6; 4 -0.635,-2.6; 5 0.635,-2.6; 6 1.905,-2.6; 7 3.175,-2.6; 8 4.445,-2.6; 9 4.445,2.6; 10 3.175,2.6; 11 1.905,2.6; 12 0.635,2.6; 13 -0.635,2.6; 14 -1.905,2.6; 15 -3.175,2.6; 16 -4.445,2.6
SCD30 = drill 1 pad 1.676 octagon: 1 0,0; 2 0,2.54; 3 0,5.08; 4 0,7.62; 5 0,10.16; 6 0,12.7; 7 0,15.24
USON6 = smd 0.6 x 0.28: 1 -0.95,0.675; 2 -0.95,0; 3 -0.95,-0.675; 4 0.95,-0.675; 5 0.95,0; 6 0.95,0.675 | smd 0.6 x 1.35: EP 0,0
0805 = smd 1.3 x 1.5: 1 -0.95,0; 2 0.95,0
3528 = smd 1.5 x 2.6: A -1.5,0; C 1.5,0
CHIPLED_0805 = smd 1.2 x 1.2: A 0,-1.05; C 0,1.05
MICRO3 = smd 0.8 x 0.9: 1 -0.95,-1; 2 0.95,-1; 3 0,1
SOT23 = smd 1 x 1.4: 1 -0.95,-1.1; 2 0.95,-1.1; 3 0,1.1
R0805' = smd 1.3 x 1.5: 1 -0.95,0; 2 0.95,0
B3F-10XX = drill 1.016 long: 1 -3.251,2.261; 2 3.251,2.261; 3 -3.251,-2.261; 4 3.251,-2.261
TS1010 = smd 0.65 x 1.3: M1 -2.325,0.65; M2 2.325,0.65 | smd 0.6 x 1.2: S1 -1.7,-1.3; S2 1.7,-1.3 | hole 0.6: -0.85,0; 0.85,0
ESP-WROOM-32 = smd 0.9 x 1.5: 1 7.7,9; 2 6.43,9; 3 5.16,9; 4 3.89,9; 5 2.62,9; 6 1.35,9; 7 0.08,9; 8 -1.19,9; 9 -2.46,9; 10 -3.73,9; 11 -5,9; 12 -6.27,9; 13 -7.54,9; 14 -8.81,9; 25 -8.81,-9; 26 -7.54,-9; 27 -6.27,-9; 28 -5,-9; 29 -3.73,-9; 30 -2.46,-9; 31 -1.19,-9; 32 0.08,-9; 33 1.35,-9; 34 2.62,-9; 35 3.89,-9; 36 5.16,-9; 37 6.43,-9; 38 7.7,-9 | smd 1.5 x 0.9: 15 -10.3,5.715; 16 -10.3,4.445; 17 -10.3,3.175; 18 -10.3,1.905; 19 -10.3,0.635; 20 -10.3,-0.635; 21 -10.3,-1.905; 22 -10.3,-3.175; 23 -10.3,-4.445; 24 -10.3,-5.715 | smd 6 x 6: GND 0,0
FIDUCIAL_1MM = smd 1 x 1: 1 0,0
XKB_U262-161N = smd 0.45 x 1.25: A1B12 -3.2,4.75; A4B9 -2.4,4.75; B1A12 3.2,4.75; B4A9 2.4,4.75 | smd 0.3 x 1.25: A5 -1.25,4.75; A6 -0.25,4.75; A7 0.25,4.75; A8 1.25,4.75; B5 1.75,4.75; B6 0.75,4.75; B7 -0.75,4.75; B8 -1.75,4.75 | drill 0.6 pad 1.016 long: P$1 -4.32,4.15; P$2 -4.32,0; P$3 4.32,4.15; P$4 4.32,0 | hole 0.65: -2.89,3.65; 2.89,3.65

### Placement (x,y rotation side)
BZ2  13.97,29.21 90 top
C1  56.83,22.23 180 top
C2  28.26,9.53 180 top
C3  56.83,24.45 180 top
C4  28.26,7.3 180 top
C5  24.77,245.11 90 top
C6  50.8,28.26 270 top
C8  47.31,248.92 270 top
C9  53.02,28.26 270 top
C10  28.89,2.22 90 top
C11  68.58,11.43 90 top
C13  54.93,2.54 270 top
D1  60.96,19.05 0 top
D2  59.05,1.91 0 top
DISP1  35.56,248.92 0 top
F1  61.59,23.18 90 top
H1  5,28 0 top
H2  65,28 0 top
H3  5,232 0 top
H4  65,232 0 top
IC1  31.75,6.99 0 top
IC2  36.2,248.92 180 top
IC3  51.44,248.92 0 top
IC4  57.78,30.16 0 top
IC5  25.4,2.54 90 top
IC6  61.91,8.89 90 top
IC7  1.59,2.54 270 top
IC8  32.38,2.22 180 top
L1  59.69,23.18 270 top
LED1  10.16,200.66 90 top
LED2  20.32,200.66 90 top
LED3  40.64,200.66 90 top
LED4  30.48,200.66 90 top
LED5  55.88,190.5 90 top
LED6  60.96,200.66 90 top
LED7  50.8,200.66 90 top
LED8  55.88,210.82 90 top
LED9  15.24,210.82 90 top
LED10  25.4,210.82 90 top
LED11  45.72,210.82 90 top
LED12  35.56,210.82 90 top
LED13  20.32,220.98 90 top
LED14  30.48,220.98 90 top
LED15  50.8,220.98 90 top
LED16  40.64,220.98 90 top
LED17  15.24,190.5 90 top
LED18  25.4,190.5 90 top
LED19  45.72,190.5 90 top
LED20  35.56,190.5 90 top
LED21  50.8,180.34 90 top
LED22  40.64,180.34 90 top
LED23  20.32,180.34 90 top
LED24  30.48,180.34 90 top
LED25  26.67,24.13 90 top
LED27  10.16,130.81 90 top
LED28  20.32,130.81 90 top
LED29  40.64,130.81 90 top
LED30  30.48,130.81 90 top
LED31  55.88,120.65 90 top
LED32  60.96,130.81 90 top
LED33  50.8,130.81 90 top
LED34  55.88,140.97 90 top
LED35  45.72,140.97 90 top
LED36  35.56,140.97 90 top
LED37  15.24,140.97 90 top
LED38  25.4,140.97 90 top
LED39  20.32,151.13 90 top
LED40  30.48,151.13 90 top
LED41  50.8,151.13 90 top
LED42  40.64,151.13 90 top
LED43  15.24,120.65 90 top
LED44  25.4,120.65 90 top
LED45  45.72,120.65 90 top
LED46  35.56,120.65 90 top
LED47  50.8,110.49 90 top
LED48  40.64,110.49 90 top
LED49  20.32,110.49 90 top
LED50  30.48,110.49 90 top
LED53  10.16,60.96 90 top
LED54  20.32,60.96 90 top
LED55  30.48,60.96 90 top
LED56  40.64,60.96 90 top
LED57  50.8,60.96 90 top
LED58  60.96,60.96 90 top
LED59  55.88,71.12 90 top
LED60  55.88,50.8 90 top
LED61  35.56,71.12 90 top
LED62  25.4,71.12 90 top
LED63  15.24,71.12 90 top
LED64  45.72,71.12 90 top
LED65  30.48,81.28 90 top
LED66  40.64,81.28 90 top
LED67  50.8,81.28 90 top
LED68  20.32,81.28 90 top
LED69  15.24,50.8 90 top
LED70  25.4,50.8 90 top
LED71  35.56,50.8 90 top
LED72  45.72,50.8 90 top
LED73  20.32,40.64 90 top
LED74  30.48,40.64 90 top
LED75  40.64,40.64 90 top
LED76  50.8,40.64 90 top
Q1  46.35,172.09 90 top
Q2  46.35,102.23 90 top
Q3  46.99,32.38 90 top
Q4  20,24.13 90 top
Q5  55.56,11.11 180 top
Q6  57.47,16.83 0 top
R1  2.2k  [R0805']  19.37,2.22 90 top
R2  2.2k  [R0805']  21.59,2.22 90 top
R3  5.1k  [R0805']  56.83,20 0 top
R4  22  [R0805']  25.4,203.2 270 top
R5  100  [R0805']  35.56,63.5 270 top
R6  22  [R0805']  50.8,213.36 270 top
R7  100  [R0805']  50.8,51.44 90 top
R8  22  [R0805']  30.48,213.36 270 top
R9  100  [R0805']  40.64,73.66 270 top
R10  22  [R0805']  35.56,221.62 90 top
R11  100  [R0805']  35.56,81.92 90 top
R12  22  [R0805']  30.48,193.04 270 top
R13  100  [R0805']  40.64,53.34 270 top
R14  22  [R0805']  35.56,182.88 270 top
R15  100  [R0805']  45.72,40.96 90 top
R16  5.1k  [R0805']  61.28,15.88 0 top
R17  10k  [R0805']  31.43,18.41 180 top
R18  10k  [R0805']  50.16,172.09 90 top
R19  22  [R0805']  25.4,133.35 270 top
R20  470  [R0805']  31.11,24.13 0 top
R21  22  [R0805']  50.8,143.51 270 top
R22  10k  [R0805']  50.8,32.38 90 top
R23  22  [R0805']  30.48,143.19 270 top
R24  10k  [R0805']  56.2,5.71 0 top
R25  22  [R0805']  35.56,151.76 90 top
R26  10k  [R0805']  22.86,24.13 270 top
R27  22  [R0805']  30.48,123.19 270 top
R29  22  [R0805']  35.56,112.71 270 top
R30  10k  [R0805']  56.2,7.94 180 top
R31  10k  [R0805']  54.93,14.92 90 top
R32  10k  [R0805']  50.16,102.23 90 top
S1  65,249 270 top
S2  5,249 270 top
SW1  67.94,5.71 270 top
U1  43.81,15.24 270 top
U$1  [ESD_10.00]  57.15,91.44 0 top
U$2  [OIL_LOGO_10]  10.16,233.68 0 top
U$3  [OIL_LOGO_50]  58.42,199.39 0 bottom
U$4  3,224 0 top
U$5  [ESD_10.00]  13.97,13.34 0 bottom
U$6  3,37 0 top
U$7  67,224 0 top
U$8  67,37 0 top
U$9  [HTWG_10]  3.17,89.53 0 top
U$10  [HTWG_TEXT_8]  59.05,141.6 0 bottom
U$11  [HTWG_20]  59.05,153.67 0 bottom
X1  68.9,19.05 90 top

### Tracks (layer width: path | path; a pad name or v marks a point on that pad's centre or on a via)
+3,3V  (via drill 0.3)
  Top 0.305: IC5.6 26.12,2.94 25.4,2.22 25.4,2.14 | 25.4,2.14 25.4,1.34 IC5.8 28.89,1.34 C10.1 | 25.4,2.14 IC5.2 | R2.1 | 50.8,28.89 C6.1 | C9.1 | 33.34,0.95 28.89,0.95 C10.1 | 29.21,1.27 C10.1 | IC8.1 33.34,0.95 | R17.2 30.48,18.09 33.02,15.56 v33.02,8.26 | 33.34,0.95 v33.97,0.95
  Top 0.406: IC5.2 23.41,2.14 22.54,1.27 R2.1 | R2.1 R1.1 2.85,1.27 IC7.1 | C11.1 68.26,10.16 67.94,10.16 66.04,8.26 IC6.4 62.55,8.26 61.91,7.62 61.91,5.08 61.28,4.45 IC6.16 58.42,4.45 58.41,4.45
  Top 0.61: IC4.2 IC4.4 54.9,33.31 53.02,31.43 C9.1 | 50.48,8.81 v50.48,6.35 53.02,6.35 53.66,5.71 53.66,4.45 54.61,3.49 C13.1 57.15,3.49 | C9.1 C6.1 v49.53,29.21 | U1.2 50.48,8.81 | 50.48,8.81 v50.48,22.23 | 57.15,3.49 57.15,4.45 | 57.15,4.45 R24.2 | 57.15,3.49 57.16,3.49 D2.C | 58.42,4.45 57.15,4.45
  Bottom 0.305: v33.02,8.26 33.66,8.26 34.92,6.99 34.92,6.35
  Bottom 0.61: v50.48,22.23 50.48,28.26 v49.53,29.21 | v50.48,6.35 34.92,6.35 33.97,5.4 v33.97,0.95
+5V  (via drill 0.3)
  Top 0.305: IC2.15 27.94,245.75 29.21,247.01 38.1,247.01 40.64,249.56 IC2.4 | 24.77,244.09 C5.1 27.94,244.16 27.94,243.84 | C4.1 29.52,6.99 | 59.64,26.7 59.96,27.01 IC4.3
  Top 0.406: BZ2.+ 13.97,36.83 | 59.64,26.7 59.64,26.3 C3.1 C1.1 L1.2 60.96,20.96 D1.5 | v29.21,16.51
  Top 0.61: C4.1 C2.1 v29.21,16.51 | 29.52,6.99 IC1.1 | 59.96,27.01 59.96,30.11 61.59,31.75 61.59,36.2 | 29.21,36.2 v29.21,26.67
  Bottom 0.61: v29.21,16.51 v29.21,26.67
  pour Top (isolate 0.305, rank 2): 0,260.4 0,34.92 70,34.92 70,260.4
BUZ
  Top 0.305: 18.96,24.17 Q4.3
  Top 0.406: 18.96,24.17 16.51,24.17 BZ2.-
BUZZER  (via drill 0.3)
  Top 0.305: v48.58,18.1 48.58,20.32 45.09,23.81 37.15,23.81 35.56,25.4 24.77,25.4 24.45,25.08 24.45,23.5 24.13,23.18 R26.2 | R26.2 | R26.2 Q4.1 | v54.61,17.46 53.66,16.51 52.9,16.51 U1.8
  Bottom 0.305: v48.58,18.1 48.58,17.14 49.21,16.51 53.66,16.51 v54.61,17.46
CC1
  Top 0.305: R16.2 62.87,16.51 62.87,17.46 63.2,17.8 X1.A5
CC2  (via drill 0.3)
  Top 0.305: R3.2 57.78,20.32 v59.05,20.32 | X1.B5 63.12,20.8 v63.02,20.7
  Bottom 0.305: v59.05,20.32 62.64,20.32 v63.02,20.7
CS  (via drill 0.3)
  Top 0.305: U1.29 36.12,18.97 v36.2,19.05 | R17.1 32.38,18.97 | IC3.2 50.13,244.47 v50.16,244.47
  Top 0.406: 32.38,18.97 U1.29
  Bottom 0.305: v36.2,19.05 36.2,24.77 43.5,32.07 43.5,34.61 50.16,41.27 50.16,53.98 54.61,58.42 54.61,102.55 55.24,103.19 55.24,239.4 v50.16,244.47
CS_5V
  Top 0.305: IC3.3 50.78,243.82 50.48,243.52 44.77,243.52 44.45,243.84 IC2.28
DTR
  Top 0.305: Q6.2 58.1,15.41 58.1,15.24 57.47,14.61 57.47,7.94 R30.1 57.15,8.26 IC6.13
EN
  Top 0.305: U1.3 52.88,10.01 53.98,10.01 | 53.98,10.01 Q5.3 | 53.98,10.01 53.98,6.99 R24.1
GND  (via drill 0.3)
  Top 0.305: IC2.25 v40.64,245.75 | IC2.18 v31.75,245.75 | R18.2 v48.58,173.03 v48.58,173.04 | Q3.2 v49.21,33.34 | C5.2 v24.77,247.65 | D1.2 60.96,16.51 R16.1 59.06,17.14 59.05,17.14 | X1.A1B12 64.15,14.73 X1.P$1 | X1.B1A12 64.15,23.37 X1.P$3 | 49.48,247.97 C8.2 v47.31,246.38 | 50.13,247.97 v51.44,247.97 | v51.44,247.97 52.09,247.97 | 52.09,247.97 53.38,247.97 IC3.7 | IC3.4 v51.44,247.97 | IC3.1 49.48,247.97 | 49.48,247.97 50.13,247.97 | 50.13,247.97 IC3.13 IC3.12 | IC3.10 52.09,247.97 | IC8.3 32.38,2.9 v32.38,3.81 | IC8.EP IC8.2
  Top 0.406: Q2.2 v48.53,103.19 R32.2 | Q1.2 R18.2 | Q3.2 R22.2
  other vias: 38.1,7.62 36.2,7.62 69.22,25.4 47.62,30.16 49.53,23.81 49.53,27.3 54.29,19.37 46.67,27.3 0.64,4.76 60.96,19.05 27.62,2.22 2.54,4.45 30.16,3.17 25.72,9.53 25.72,7.3 30.48,16.51 36.51,16.51 36.51,13.02 38.73,11.11 27.62,3.81 24.45,13.34 0.95,24.77 22.86,26.67 30.48,22.54 32.07,22.54 25.72,22.54 19.68,13.34 30.48,10.79 38.73,22.23 36.2,26.67 26.04,26.67 43.81,27.3 49.53,15.24 49.53,7.3 49.53,10.16 53.66,1.59 64.45,2.86 61.91,9.53 66.67,2.86 60.33,14.29 49.53,18.41 58.74,17.14 55.56,28.89 46.35,19.37 63.18,23.18 67.94,13.65 68.9,16.19 68.9,21.91 62.87,14.29 69.22,5.71 58.42,3.17 51.44,7.3 60.96,3.17 23.5,0.64 16.83,5.08 30.8,33.02 27.62,33.02 1.59,33.66 54.29,20.64 55.56,30.16 53.66,25.72 56.2,0.64
  pour Bottom (isolate 0.305, rank 2): 0,260.4 0,0 70,0 70,260.4
  pour Top (isolate 0.305): 0,34.34 0,0 70,0 70,34.34
GRID1
  Top 0.305: DISP1.2 33.66,239.71 39.37,239.71 40.64,240.98 40.64,241.94 39.37,243.21 IC2.24
GRID2
  Top 0.305: DISP1.3 35.56,240.35 37.47,240.35 38.1,240.98 IC2.23
GRID3
  Top 0.305: IC2.22 36.83,243.21 36.2,242.57 31.11,242.57 30.48,241.94 30.48,240.66 32.07,239.08 40.01,239.08 41.91,240.98 DISP1.6
GRID4  (via drill 0.3)
  Top 0.305: IC2.21 v35.56,245.75
  Bottom 0.305: DISP1.10 32.38,254.31 32.38,250.19 33.02,249.56 34.92,249.56 35.56,248.92 v35.56,245.75
I2C_SCL
  Top 0.305: U1.36 35.96,10.08 37.15,8.89 37.15,7.3 36.2,6.35 34.92,6.35 33.34,4.76 31.43,4.76 | 31.43,4.76 24.2,4.76 | 24.2,4.76 20.96,4.76 R1.2 18.73,3.81 7.94,3.81 IC7.3 | IC5.4 24.2,4.76 | IC8.4 31.43,4.76
I2C_SDA  (via drill 0.3)
  Top 0.305: IC5.3 v22.86,2.94 21.82,2.94 R2.2 | U1.33 33.89,13.89 33.66,13.65 33.66,6.35 v33.02,5.71 | v30.16,1.59 30.2,1.55 IC8.6
  Bottom 0.305: IC7.4 10.48,1.27 21.19,1.27 v22.86,2.94 28.81,2.94 v30.16,1.59 33.02,1.59 33.34,1.91 33.34,5.4 v33.02,5.71
IO0  (via drill 0.3)
  Top 0.305: Q6.3 57.32,17.78 v56.52,17.78 | U1.25 35.96,24.05 36.83,23.18 44.77,23.18 47.62,20.32 47.62,17.78 48.26,17.14 v49.53,17.14
  Bottom 0.305: v49.53,17.14 52.7,17.14 53.98,18.41 55.88,18.41 v56.52,17.78
LED_G  (via drill 0.3)
  Top 0.305: R22.1 v52.07,31.43 | v51.44,21.27 52.81,21.27 U1.12
  Top 0.406: Q3.1 R22.1
  Bottom 0.305: v51.44,21.27 51.44,30.8 v52.07,31.43
LED_G_GND  (via drill 0.3)
  Top 0.406: v35.56,66.04 R5.1 | Q3.3 v42.55,32.38 | v40.64,55.56 R13.1 | v40.64,76.2 R9.1 | R11.1 v35.56,79.38 | R7.1 50.8,48.58 v49.21,46.99 | R15.1 v45.72,38.1
  Bottom 0.406: v42.55,32.38 42.55,34.92 v45.72,38.1 49.21,41.59 v49.21,46.99 v40.64,55.56 35.56,60.64 v35.56,66.04 40.64,71.12 v40.64,76.2 37.47,79.38 v35.56,79.38
LED_R  (via drill 0.3)
  Top 0.305: v51.44,19.05 52.73,19.05 U1.10 | R18.1 57.15,171.13 v57.47,170.81
  Top 0.406: Q1.1 R18.1
  Bottom 0.305: v57.47,170.81 57.47,56.2 53.98,52.7 53.98,31.11 52.7,29.84 52.7,20.32 v51.44,19.05
LED_R_GND  (via drill 0.3)
  Top 0.406: v25.4,205.74 R4.1 | v30.48,195.58 R12.1 | R8.1 v30.48,215.9 | v35.56,218.44 R10.1 | v50.8,215.9 R6.1 | Q1.3 43.81,172.09 v42.55,173.35 | v35.56,185.42 R14.1
  Bottom 0.406: v50.8,215.9 48.26,218.44 v35.56,218.44 33.02,218.44 v30.48,215.9 25.4,210.82 v25.4,205.74 25.4,200.66 v30.48,195.58 35.56,190.5 v35.56,185.42 35.56,180.34 v42.55,173.35
LED_STATUS
  Top 0.305: U1.26 33.41,22.78 R20.2
LED_Y  (via drill 0.3)
  Top 0.305: R32.1 v56.83,101.28 | v51.44,20.32 52.73,20.32 U1.11
  Top 0.406: Q2.1 R32.1
  Bottom 0.305: v56.83,101.28 56.52,100.97 56.52,56.52 53.02,53.02 53.02,31.11 52.07,30.16 52.07,20.95 v51.44,20.32
LED_Y_GND  (via drill 0.3)
  Top 0.406: R19.1 v25.4,135.89 | v30.48,125.73 R27.1 | Q2.3 43.81,102.23 v42.55,103.5 | v50.8,146.05 R21.1 | v35.56,148.59 R25.1 | v35.56,115.57 R29.1 | R23.1 v30.48,146.05
  Bottom 0.406: v50.8,146.05 48.26,148.59 v35.56,148.59 33.02,148.59 31.11,146.69 v30.48,146.05 25.4,140.97 v25.4,135.89 25.4,130.81 v30.48,125.73 35.56,120.65 v35.56,115.57 35.56,110.49 v42.55,103.5
MH_RXD
  Top 0.305: U1.28 29.77,20.24 19.05,9.53 IC1.8
MH_TXD
  Top 0.305: IC1.7 20.32,12.06 29.77,21.51 U1.27
MOSI  (via drill 0.3)
  Top 0.305: U1.37 36.12,8.81 v36.2,8.89 | v52.7,250.19 52.73,250.22 IC3.9
  Bottom 0.305: v36.2,8.89 37.47,10.16 37.47,23.5 45.4,31.43 45.4,33.97 52.07,40.64 52.07,53.34 55.88,57.15 55.88,101.6 56.52,102.23 56.52,241.3 52.7,245.11 v52.7,250.19
MOSI_5V
  Top 0.305: IC2.26 41.91,243.21 43.18,241.94 51.75,241.94 53.98,244.16 53.98,249.87 53.38,250.46 IC3.8
N$1
  Top 0.305: R20.1 LED25.A
N$3
  Top 0.406: LED1.C 13.74,202.16 16.74,199.16 LED2.A
N$4
  Top 0.406: LED4.A 34.06,199.16 37.06,202.16 LED3.C
N$5
  Top 0.406: LED5.C 55.88,197.49 57.55,199.16 LED6.A
N$6
  Top 0.406: LED4.C 25.31,202.16 | LED2.C 24.77,202.16 25.31,202.16 | R4.2 25.31,202.16
N$7
  Top 0.406: LED53.C LED54.C LED55.C 35.65,62.46 | LED56.C 36.2,62.46 35.65,62.46 | R5.2 35.65,62.46
N$8
  Top 0.406: R6.2 50.89,212.32 LED8.C 58.83,212.32 60.96,210.19 LED6.C
N$9
  Top 0.406: LED7.C 50.8,207.01 53.11,209.32 LED8.A
N$10
  Top 0.305: R31.2 54.93,15.56 56.52,15.56 Q6.1
N$11
  Top 0.406: LED9.C 18.82,212.32 21.82,209.32 LED10.A
N$12
  Top 0.406: LED12.A 39.14,209.32 42.14,212.32 LED11.C
N$13
  Top 0.305: Q5.1 56.51,9.2 R30.2
N$14
  Top 0.406: LED10.C 30.48,212.32 | 30.48,212.32 LED12.C | R8.2 30.48,212.32
N$15
  Top 0.406: LED59.C 58.83,72.62 60.96,70.48 LED58.C | LED58.C 63.91,62.46 64.14,62.23 64.14,55.88 60.55,52.3 LED60.C 50.88,52.3 R7.2 | LED57.C LED58.C
N$16
  Top 0.406: LED13.C 23.9,222.48 26.9,219.48 LED14.A
N$17
  Top 0.406: LED16.A 44.22,219.48 47.22,222.48 LED15.C
N$18
  Top 0.406: LED17.C 18.82,192 21.82,189 LED18.A
N$19
  Top 0.406: LED14.C 34.92,222.48 35.48,222.48 | 35.48,222.48 LED16.C | R10.2 35.48,222.48
N$21
  Top 0.406: LED18.C 30.48,192 | 30.48,192 LED20.C | R12.2 30.48,192
N$22
  Top 0.406: LED20.A 39.14,189 42.14,192 LED19.C
N$23
  Top 0.406: LED63.C LED62.C LED61.C 40.64,72.62 | LED64.C 40.64,72.62 | R9.2 40.64,72.62
N$24
  Top 0.406: LED22.A 44.22,178.84 47.22,181.84 LED21.C
N$25
  Top 0.406: LED23.C 23.9,181.84 26.9,178.84 LED24.A
N$26
  Top 0.406: LED24.C 35.56,181.84 | 35.56,181.84 LED22.C | R14.2 35.56,181.84
N$30
  Top 0.406: LED27.C 13.74,132.31 16.51,129.54 20.09,129.54 LED28.A
N$31
  Top 0.406: LED30.A 34.06,129.31 37.06,132.31 LED29.C
N$32
  Top 0.406: LED31.C 55.88,127.64 57.55,129.31 LED32.A
N$33
  Top 0.406: LED28.C 25.4,132.31 | 25.4,132.31 LED30.C | R19.2 25.4,132.31
N$34
  Top 0.406: 35.48,82.78 LED66.C LED67.C | LED67.C 51.03,82.78 51.44,83.19 51.2,83.19 LED67.C | LED68.C LED65.C 34.29,82.78 35.48,82.78 | R11.2 35.48,82.78
N$35
  Top 0.406: R21.2 50.8,142.47 LED34.C 58.83,142.47 60.96,140.34 LED32.C
N$36
  Top 0.406: LED33.C 50.8,137.16 53.11,139.47 LED34.A
N$37
  Top 0.406: LED35.C 42.14,142.47 39.14,139.47 LED36.A
N$38
  Top 0.406: LED37.C 18.82,142.47 21.82,139.47 LED38.A
N$40
  Top 0.406: LED38.C 30.48,142.47 | 30.48,142.47 LED36.C | R23.2 30.48,142.47
N$41
  Top 0.406: LED69.C LED70.C LED71.C 40.64,52.3 | 40.64,52.3 LED72.C | R13.2 40.64,52.3
N$42
  Top 0.406: LED39.C 23.9,152.63 26.9,149.63 LED40.A
N$43
  Top 0.406: LED42.A 44.22,149.63 47.22,152.63 LED41.C
N$44
  Top 0.406: LED43.C 18.82,122.15 21.59,119.38 25.17,119.38 LED44.A
N$45
  Top 0.406: LED40.C 35.56,152.63 | 35.56,152.63 LED42.C | R25.2 35.56,152.63
N$46
  Top 0.406: 45.72,42.14 LED75.C LED74.C LED73.C | 45.72,42.14 LED76.C | R15.2 45.72,42.14
N$47
  Top 0.406: LED46.C 30.48,122.15 | 30.48,122.15 LED44.C | R27.2 30.48,122.15
N$48
  Top 0.406: LED46.A 39.14,119.15 41.91,121.92 45.49,121.92 LED45.C
N$50
  Top 0.406: LED48.A 44.22,108.99 47.22,111.99 LED47.C
N$51
  Top 0.406: LED49.C 23.9,111.99 26.9,108.99 LED50.A
N$52
  Top 0.406: LED50.C 35.56,111.99 | 35.56,111.99 LED48.C | R29.2 35.56,111.99
RTS  (via drill 0.3)
  Top 0.305: v54.29,10.79 54.61,11.12 Q5.2 54.61,13.97 R31.1 | 58.42,6.99 IC6.14 60.64,6.99 60.96,7.3 v60.96,7.62
  Bottom 0.305: v54.29,10.79 57.78,10.79 v60.96,7.62
SCK  (via drill 0.3)
  Top 0.305: U1.30 36.75,17.7 v36.83,17.78 | v52.07,244.47 52.09,244.49 IC3.5
  Bottom 0.305: v52.07,244.47 55.88,240.66 55.88,102.87 55.24,102.23 55.24,57.78 51.12,53.66 51.12,40.96 44.45,34.29 44.45,31.75 36.83,24.13 v36.83,17.78
SCK_5V
  Top 0.305: IC3.6 52.73,243.87 51.44,242.57 43.5,242.57 43.18,242.89 IC2.27
SEG1
  Top 0.305: DISP1.8 IC2.5
SEG2
  Top 0.305: DISP1.7 40.95,257.18 38.73,257.18 38.1,256.54 IC2.6
SEG3  (via drill 0.3)
  Top 0.305: v35.56,255.91 36.83,254.63 IC2.7
  Bottom 0.305: DISP1.12 30.16,257.18 34.92,257.18 35.56,256.54 v35.56,255.91
SEG4  (via drill 0.3)
  Top 0.305: v35.56,250.19 IC2.8
  Bottom 0.305: DISP1.4 36.83,248.92 v35.56,250.19
SEG5  (via drill 0.3)
  Top 0.305: IC2.9 v34.29,248.28
  Bottom 0.305: DISP1.1 34.29,246.7 v34.29,248.28
SEG6
  Top 0.305: IC2.10 33.02,256.54 33.66,257.18 35.88,257.18 DISP1.9
SEG7  (via drill 0.3)
  Top 0.305: v33.02,250.82 31.75,252.09 IC2.11
  Bottom 0.305: DISP1.5 39.37,247.65 36.2,250.82 v33.02,250.82
SEG8
  Top 0.305: IC2.12 30.48,254.95 DISP1.11
SWITCH_ALERT  (via drill 0.3)
  Top 0.305: v54.61,24.13 52.9,24.13 U1.14
  Bottom 0.305: S1.3 59.37,248.88 59.37,55.56 55.88,52.07 55.88,35.24 54.61,33.97 v54.61,24.13
SWITCH_BRIGHT  (via drill 0.3)
  Top 0.305: S2.3 9.57,259.08 52.7,259.08 v58.42,253.37 | v54.93,35.56 v52.39,33.02 | v48.26,24.13 U1.16
  Bottom 0.305: v58.42,253.37 58.42,55.88 54.93,52.39 v54.93,35.56 | v48.26,24.13 48.26,28.89 v52.39,33.02
SWITCH_CAL  (via drill 0.3)
  Top 0.305: SW1.S1 66.64,6.38 v66.67,6.35 | v51.44,10.16 51.44,17.46 51.75,17.78 52.73,17.78 U1.9
  Bottom 0.305: v66.67,6.35 65.41,7.62 62.23,7.62 60.96,6.35 56.83,6.35 53.02,10.16 v51.44,10.16
USB_DM
  Top 0.305: 62.87,18.3 X1.B7 65.84,18.3 66.36,17.78 66.36,11.43 65.72,10.79 IC6.6 | X1.A7 62.87,19.3 62.87,18.3 | 62.87,18.3 61.91,18.3 D1.3
USB_DP
  Top 0.305: X1.A6 65.41,18.8 | 65.41,18.8 65.41,19.8 X1.B6 61.91,19.8 D1.4 | IC6.5 65.72,9.53 66.99,10.79 66.99,18.1 66.29,18.8 65.41,18.8
USB_RXD  (via drill 0.3)
  Top 0.305: U1.35 35.64,11.35 38.1,8.89 v40.64,8.89 | IC6.3 v62.87,6.99
  Bottom 0.305: v62.87,6.99 61.59,5.71 56.52,5.71 53.34,8.89 v40.64,8.89
USB_TXD  (via drill 0.3)
  Top 0.305: U1.34 35.64,12.62 38.42,9.84 v39.37,9.84 | v62.87,5.71 IC6.2
  Bottom 0.305: v39.37,9.84 39.37,8.89 40.01,8.26 53.02,8.26 56.2,5.08 62.23,5.08 v62.87,5.71
VBUS  (via drill 0.3)
  Top 0.305: X1.B4A9 64.59,21.45 | X1.A4B9 64.59,16.65
  Top 0.406: X1.B4A9 62.32,21.45 F1.1 | 64.59,21.45 arc-90 v65.41,20.64 | 64.59,16.65 arc90 v65.41,17.46
  Bottom 0.406: v65.41,17.46 v65.41,20.64
VIN
  Top 0.61: F1.2 59.74,24.18 L1.1

### Text on the board
tPlace: BRIGHT | ALERT | CO2-Ampel | 11/2020 S. Oechslein | ESP32 | MH-Z19B | Senseair S8 | SCD030 | BME680 | OPT3001 | CALIB
bPlace: CO2-Ampel | 11/2020 S. Oechslein | 5V 1A
tDocu: Yellow LEDs have wrong cathode marking! Rotate 180